# EasyEDA Pro project CameraTarget-0.9.eprj, board PCB1
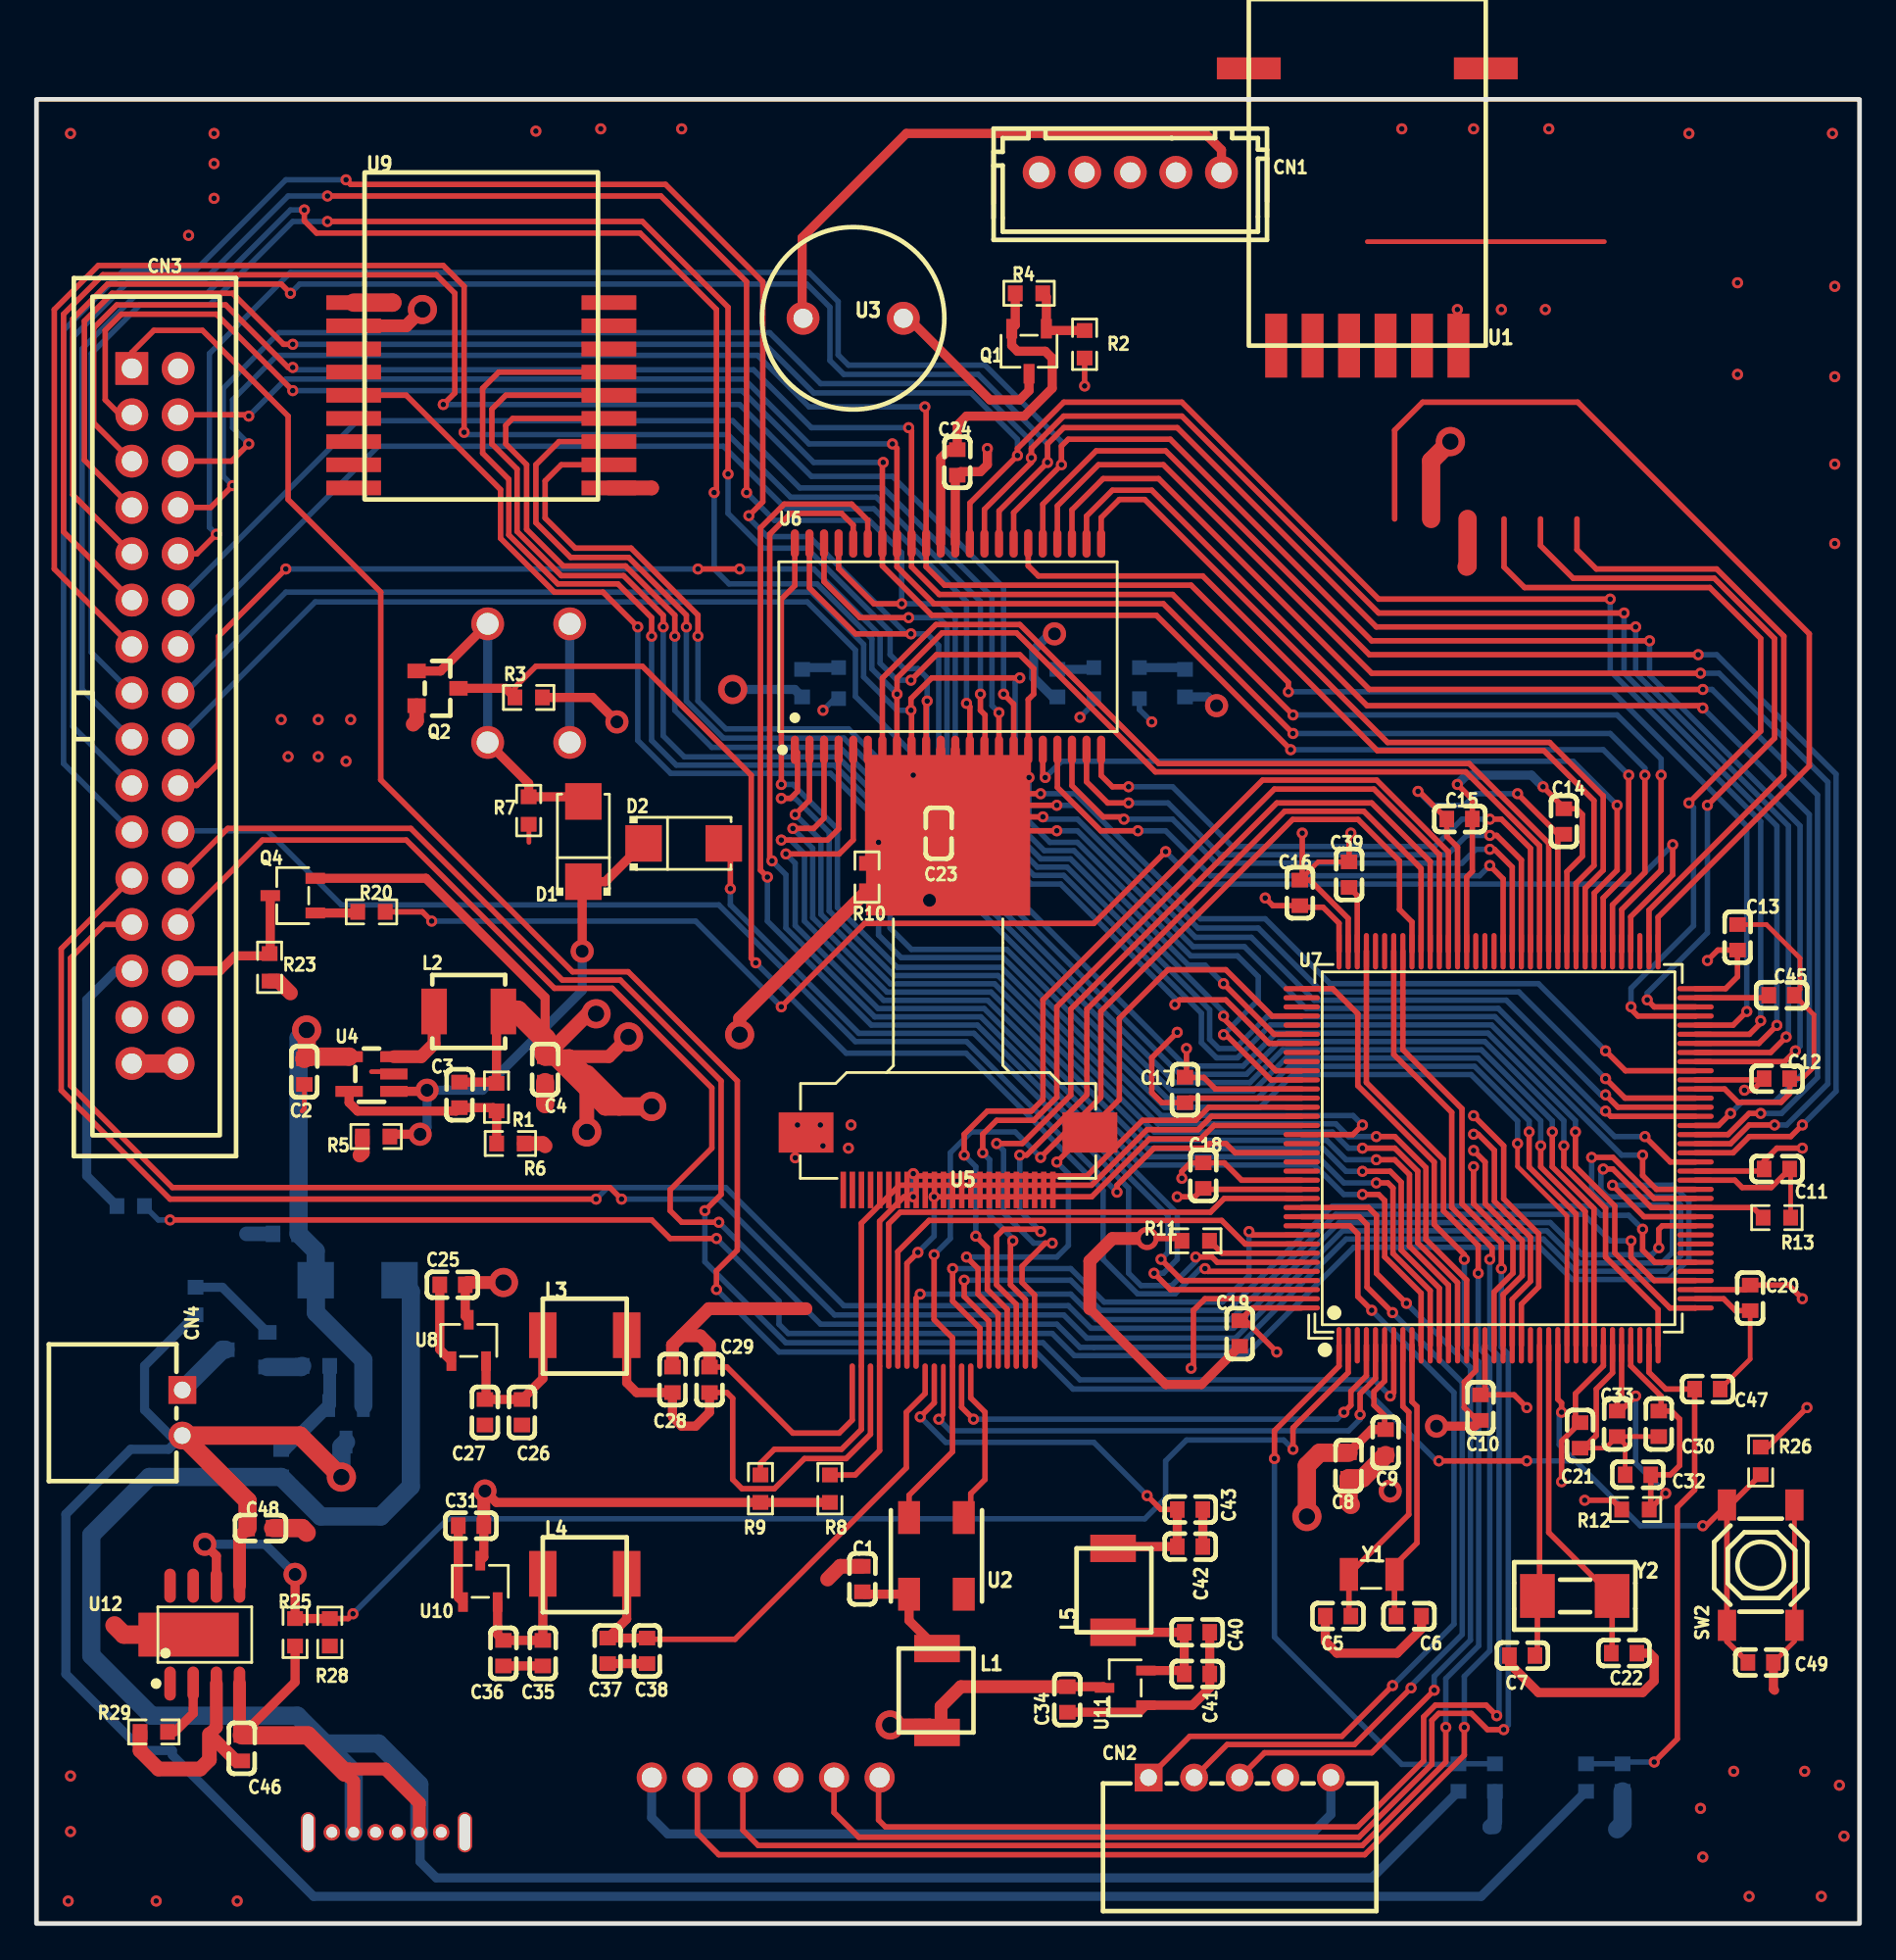
[diagram p1: board, top side]
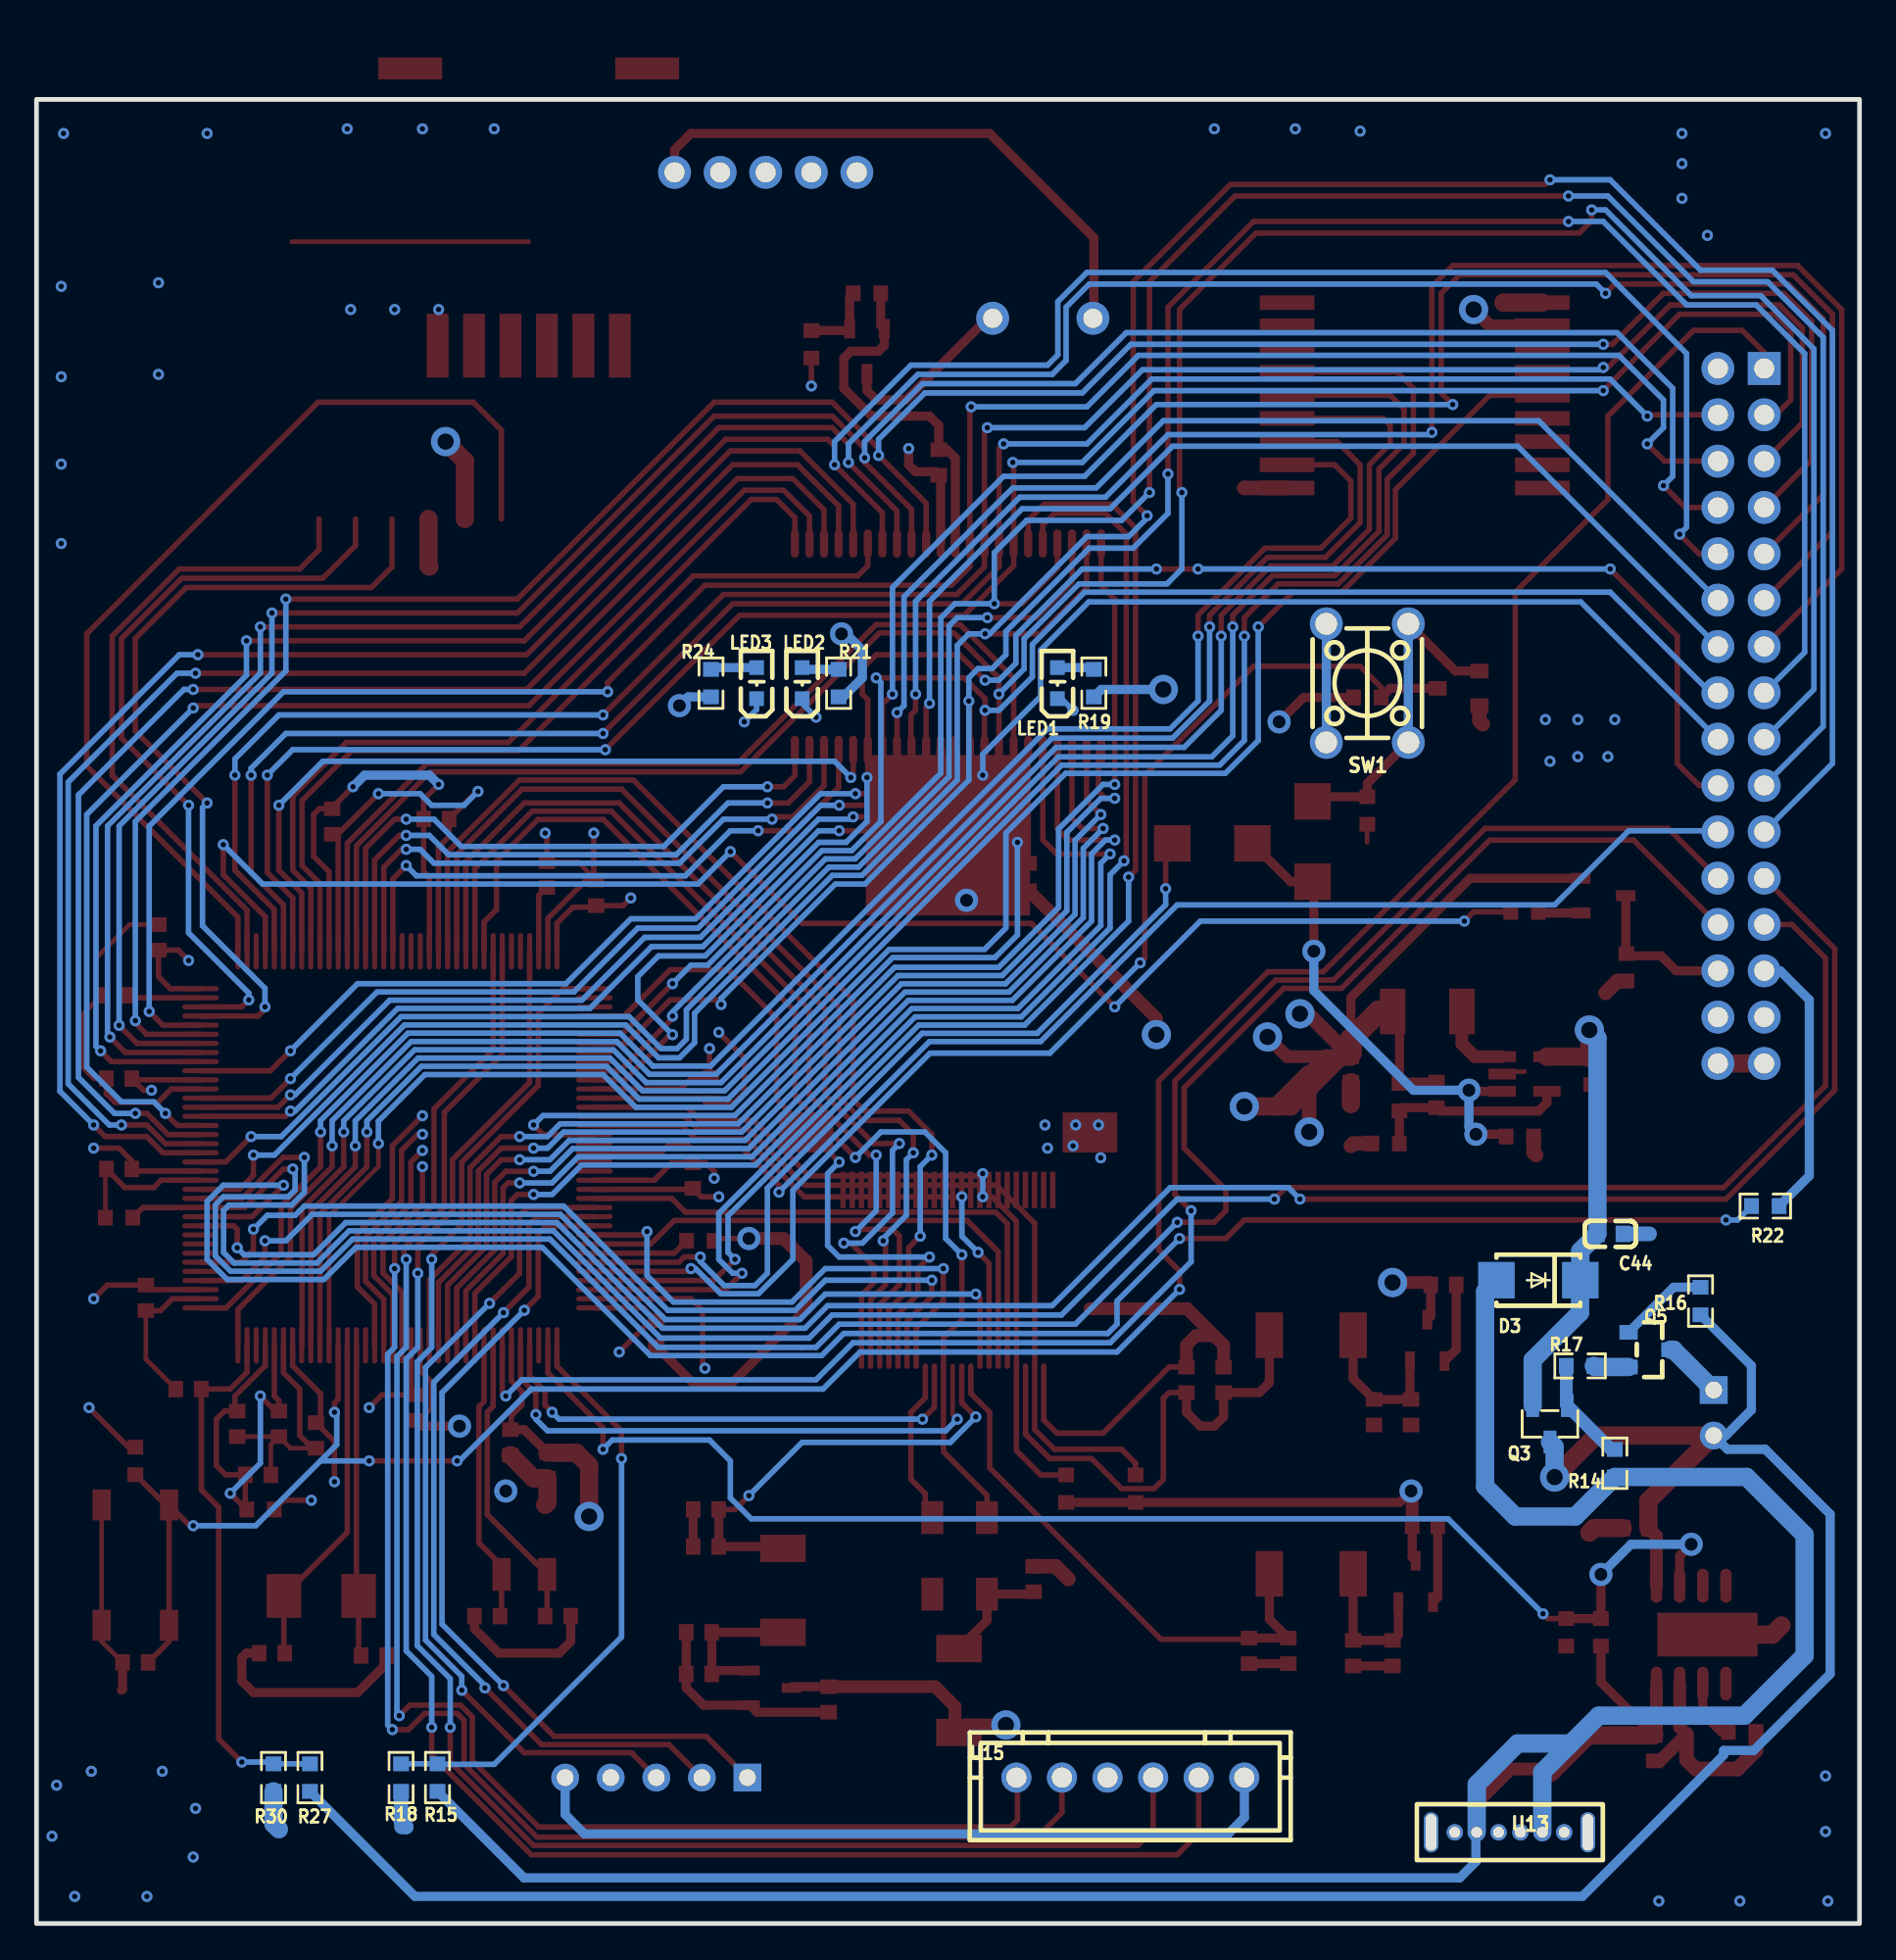
[diagram p2: board, bottom side, seen from below]

Outline 100 x 100 mm; copper layers: Top Layer, CPU1, CPU2, Bottom Layer. Coordinates in mm from the lower left corner of the outline.
Outline path: rectangle 0,100 100,0
Stack: Top Layer 0.035mm / Dielectric1 0.48mm PP er 4.5 / CPU1 0.035mm / Dielectric2 0.48mm FR4 er 4.5 / CPU2 0.035mm / Dielectric3 0.48mm PP er 4.5 / Bottom Layer 0.035mm

## Design rules (mm)
spacing safeClearance (default): track to track 0.152, other pairs 0.152 to 0.3
track width trackWidth (default): min 0.127, default 0.254, max 2.54
differential pair differentialPair (default): width min 0.127, default 0.254, max 2.54; gap min 0.152, default 0.152
via viaSize (default): diameter min 0.5, default 0.61, max 10; hole min 0.3, default 0.305, max 6

## Placement (name value [footprint] x y rotation side)
C1  0.1uF  [C0603]  45.3 18.88 270 top
C2  10uF  [C0603]  14.69 46.7 90 top
C3  22pF  [C0603]  23.2 45.43 270 top
C4  10uF  [C0603]  27.9 46.83 90 top
C5  15pF  [C0603]  71.4 16.85 0 top
C6  15pF  [C0603]  75.27 16.85 180 top
C7  22pF  [C0603]  81.5 14.69 180 top
C8  10uF  [C0603]  71.97 25.11 90 top
C9  0.1uF  [C0603]  74 26.38 90 top
C10  0.1uF  [C0603]  79.21 28.28 90 top
C11  0.1uF  [C0603]  95.47 41.36 180 top
C12  0.1uF  [C0603]  95.47 46.32 180 top
C13  0.1uF  [C0603]  93.31 54.06 270 top
C14  0.1uF  [C0603]  83.78 60.41 270 top
C15  0.1uF  [C0603]  78.06 60.55 180 top
C16  0.1uF  [C0603]  69.3 56.5 270 top
C17  0.1uF  [C0603]  63 45.7 270 top
C18  0.1uF  [C0603]  64 41 270 top
C19  0.1uF  [C0603]  66 32.35 90 top
C20  0.1uF  [C0603]  94 34.3 90 top
C21  0.1uF  [C0603]  84.67 26.76 90 top
C22  22pF  [C0603]  87.08 14.82 0 top
C23  0.1uF  [C0603]  49.49 59.78 90 top
C24  0.1uF  [C0603]  50.51 80.1 270 top
C25  1uF  [C0603]  22.82 35.01 0 top
C26  0.1uF  [C0603]  26.63 28.03 90 top
C27  10uF  [C0603]  24.6 28.03 90 top
C28  10uF  [C0603]  34.89 29.81 270 top
C29  0.1uF  [C0603]  36.92 29.81 270 top
C30  0.1uF  [C0603]  88.99 27.39 90 top
C31  1uF  [C0603]  23.84 21.81 0 top
C32  10uF  [C0603]  87.85 24.6 0 top
C33  2.2uF  [C0603]  86.7 27.39 90 top
C34  1uF  [C0603]  56.55 12.28 90 top
C35  0.1uF  [C0603]  27.78 14.82 90 top
C36  10uF  [C0603]  25.62 14.82 90 top
C37  10uF  [C0603]  31.33 14.95 90 top
C38  0.1uF  [C0603]  33.49 14.95 90 top
C39  2.2uF  [C0603]  72 57.5 270 top
C40  0.1uF  [C0603]  63.66 15.97 180 top
C41  10uF  [C0603]  63.66 13.68 180 top
C42  10uF  [C0603]  63.28 20.67 180 top
C43  0.1uF  [C0603]  63.28 22.7 180 top
C44  4.7uF  [C0603]  13.68 37.81 0 bottom
C45  2.2uF  [C0603]  95.72 50.89 180 top
C46  1uF  [C0603]  11.27 9.61 90 top
C47  0.1uF  [C0603]  91.66 29.3 180 top
C48  4.7uF  [C0603]  12.28 21.68 180 top
C49  0.1uF  [C0603]  94.58 14.31 180 top
CN1  灯板连接口  [CONN-TH_5P-P2.50_HX25003-5A]  60 96 0 top
CN2  HDGC2501WR-5P  [CONN-TH_5P-P2.50_HDGC2501WR-5P]  66 8 0 top
CN3  BH-00169  [IDC-TH_BH-00169]  6.5 66.2 270 top
CN4  HDGC2501WR-2P  [CONN-TH_2P-P2.50_HDGC2501WR-2P]  8 28 270 top
D1  SS14A  [SMA_L4.3-W2.6-LS5.2-RD]  30 59.31 90 top
D2  SS14A  [SMA_L4.3-W2.6-LS5.2-RD]  35.5 59.22 0 top
D3  -  [DO-214AC_L4.3-W2.7-LS5.3-RD]  17.61 35.27 0 bottom
L1  -  [0420]  51.4 15.07 270 top
L2  2.2uH  [IND-SMD_L4.0-W4.0_0.47UH04209.5A]  23.71 50 0 top
L3  -  [0420]  27.78 34.25 0 top
L4  -  [0420]  27.78 21.17 0 top
L5  -  [0420]  57.05 15.97 90 top
LED1  RED  [LED0603-R-RD_RED]  44 68 90 bottom
LED2  NCD0603R3  [LED0603-R-RD_RED]  58 68 90 bottom
LED3  NCD0603R3  [LED0603-R-RD_RED]  60.5 68 90 bottom
Q1  S8050  [SOT-23-3_L2.9-W1.6-P1.90-LS2.8-BR]  54.44 86.19 90 top
Q2  AO3400  [SOT-23_L2.9-W1.3-P1.90-LS2.4-BR]  22 67.72 180 top
Q3  -  [SOT-23-3_L2.9-W1.3-P1.90-LS2.4-BR]  16.98 27.39 90 bottom
Q4  SS8550  [SOT-23-3_L2.9-W1.6-P1.90-LS2.8-BR]  14.06 56.35 0 top
Q5  AO3400  [SOT-23_L2.9-W1.3-P1.90-LS2.4-BR]  11.52 31.46 0 bottom
R1  453kΩ  [R0603]  25.23 45.3 90 top
R2  1kΩ  [R0603]  57.49 86.58 270 top
R3  100kΩ  [R0603]  27 67.22 0 top
R4  10kΩ  [R0603]  54.44 89.37 180 top
R5  100kΩ  [R0603]  18.63 43.14 0 top
R6  100kΩ  [R0603]  26 42.76 180 top
R7  10kΩ  [R0603]  27 61.02 270 top
R8  4.7kΩ  [R0603]  43.52 23.84 270 top
R9  4.7kΩ  [R0603]  39.71 23.84 270 top
R10  10kΩ  [R0603]  45.56 57.37 270 top
R11  10kΩ  [R0603]  63.59 37.43 0 top
R12  10Ω  [R0603]  87.71 22.69 180 top
R13  10kΩ  [R0603]  95.47 38.7 0 top
R14  1kΩ  [R0603]  13.42 25.24 270 bottom
R15  20kΩ  [R0603]  78 8 270 bottom
R16  10kΩ  [R0603]  8.72 34.12 270 bottom
R17  10kΩ  [R0603]  15.33 30.57 0 bottom
R18  30kΩ  [R0603]  80 8 90 bottom
R19  1kΩ  [R0603]  42 68 270 bottom
R20  10kΩ  [R0603]  18.38 55.46 180 top
R21  1kΩ  [R0603]  56 68 270 bottom
R22  10kΩ  [R0603]  5.17 39.33 0 bottom
R23  10kΩ  [R0603]  12.79 52.42 270 top
R24  1kΩ  [R0603]  63 68 270 bottom
R25  20kΩ  [R0603]  14.19 15.96 270 top
R26  10kΩ  [R0603]  94.58 25.36 270 top
R27  300kΩ  [R0603]  85 8 270 bottom
R28  30kΩ  [R0603]  16.09 15.96 90 top
R29  3kΩ  [R0603]  6.44 10.5 0 top
R30  100kΩ  [R0603]  87 8 90 bottom
SW1  -  [按钮开关]  27 68 270 bottom
SW2  1TS001G-2700-1500-CT  [SW-SMD_4P-L5.1-W5.1-P3.70-LS6.5-TL-2]  94.58 19.65 90 top
U1  -  [GC2400-TC010R]  73 96 0 top
U2  -  [5032-4P]  49.37 20.16 90 top
U3  -  [0905蜂鸣器]  44.8 88 0 top
U4  -  [PW2051]  18.38 46.57 0 top
U5  -  [OV2640]  50 50 0 top
U6  IS62WV51216BLL-55TLI  [TSOP-44_L18.4-W10.2-P0.80-LS11.8-BL]  50 70 0 top
U7  STM32F407ZGT6  [LQFP-144_L20.0-W20.0-P0.50-LS22.0-BL]  80.2 42.5 0 top
U8  -  [SOT-23-3_L2.9-W1.6-P1.90-LS2.9-BL]  23.71 31.97 0 top
U9  -  [XY-MBA32A]  18 96 0 top
U10  -  [SOT-23-3_L2.9-W1.6-P1.90-LS2.9-BL]  24.35 18.76 0 top
U11  -  [SOT-23-3_L2.9-W1.6-P1.90-LS2.9-BL]  59.72 12.92 90 top
U12  -  [PW4056]  9.23 15.84 0 top
U13  -  [typec]  19.2 5 180 bottom
U15  HDGC2501WV-6P  [CONN-TH_XH2.54-6P]  40 8 180 bottom
Y1  -  [3215]  73.24 19.14 180 top
Y2  -  [5032]  84.34 17.96 180 top

## Footprints (pads in the part's own frame, mm; a bottom-side part is the same pattern mirrored in y, then rotated)
0420
  rect 1.5x2.5 smd: 1(0,-2) 2(4.6,-2)
0905蜂鸣器
  round 1.8 hole 1.05: 1(-2.75,0) 2(2.75,0)
3215
  rect 1x1.8 smd: 1(-1.25,0) 2(1.25,0)
5032
  rect 1.9x2.401 smd: 1(-2.093,0) 2(2.007,0)
5032-4P
  rect 1.8x1.2 smd: 1(-2.1,-1.5) 2(2.1,-1.5) 3(2.1,1.5) 4(-2.1,1.5)
C0603
  rect 0.8x0.9 smd: 1(-0.7,0) 2(0.7,0)
CONN-TH_2P-P2.50_HDGC2501WR-2P
  rect 1.524x1.524 hole 0.914: 1(-1.25,0)
  round 1.524 hole 0.914: 2(1.25,0)
CONN-TH_5P-P2.50_HDGC2501WR-5P
  rect 1.524x1.524 hole 0.914: 1(-5,0)
  round 1.524 hole 0.914: 2(-2.5,0) 3(0,0) 4(2.5,0) 5(5,0)
CONN-TH_5P-P2.50_HX25003-5A
  round 1.8 hole 1.1: 1(-5,0) 2(-2.5,0) 3(0,0) 4(2.5,0) 5(5,0)
CONN-TH_XH2.54-6P
  round 1.65 hole 1.1: 1(-6.25,0) 2(-3.75,0) 3(-1.25,0) 4(1.25,0) 5(3.75,0) 6(6.25,0)
DO-214AC_L4.3-W2.7-LS5.3-RD
  rect 1.999x1.999 smd: 1(-2.299,0) 2(2.301,0)
GC2400-TC010R
  rect 1.2x3.5 smd: 1(-5,-9.5) 2(-3,-9.5) 3(-1,-9.5) 4(1,-9.5) 5(3,-9.5) 6(5,-9.5)
  rect 3.5x1.2 smd: 7(6.5,5.7) 8(-6.5,5.7)
IDC-TH_BH-00169
  rect 1.8x1.8 hole 1.1: 1(-19.05,-1.27)
  round 1.8 hole 1.1: 2(-19.05,1.27) 3(-16.51,-1.27) 4(-16.51,1.27) 5(-13.97,-1.27) 6(-13.97,1.27) 7(-11.43,-1.27) 8(-11.43,1.27) 9(-8.89,-1.27) 10(-8.89,1.27) 11(-6.35,-1.27) 12(-6.35,1.27) 13(-3.81,-1.27) 14(-3.81,1.27) 15(-1.27,-1.27) 16(-1.27,1.27) 17(1.27,-1.27) 18(1.27,1.27) 19(3.81,-1.27) 20(3.81,1.27) 21(6.35,-1.27) 22(6.35,1.27) 23(8.89,-1.27) 24(8.89,1.27) 25(11.43,-1.27) 26(11.43,1.27) 27(13.97,-1.27) 28(13.97,1.27) 29(16.51,-1.27) 30(16.51,1.27) 31(19.05,-1.27) 32(19.05,1.27)
IND-SMD_L4.0-W4.0_0.47UH04209.5A
  rect 1.399x2.499 smd: 1(-1.9,0) 2(1.9,0)
LED0603-R-RD_RED
  rect 0.8x0.8 smd: 1(0.851,0) 2(-0.851,0)
LQFP-144_L20.0-W20.0-P0.50-LS22.0-BL
  oval 0.28x2 smd: 1(-8.75,-10.8) 2(-8.25,-10.8) 3(-7.75,-10.8) 4(-7.25,-10.8) 5(-6.75,-10.8) 6(-6.25,-10.8) 7(-5.75,-10.8) 8(-5.25,-10.8) 9(-4.75,-10.8) 10(-4.25,-10.8) 11(-3.75,-10.8) 12(-3.25,-10.8) 13(-2.75,-10.8) 14(-2.25,-10.8) 15(-1.75,-10.8) 16(-1.25,-10.8) 17(-0.75,-10.8) 18(-0.25,-10.8) 19(0.25,-10.8) 20(0.75,-10.8) 21(1.25,-10.8) 22(1.75,-10.8) 23(2.25,-10.8) 24(2.75,-10.8) 25(3.25,-10.8) 26(3.75,-10.8) 27(4.25,-10.8) 28(4.75,-10.8) 29(5.25,-10.8) 30(5.75,-10.8) 31(6.25,-10.8) 32(6.75,-10.8) 33(7.25,-10.8) 34(7.75,-10.8) 35(8.25,-10.8) 36(8.75,-10.8) 73(8.75,10.8) 74(8.25,10.8) 75(7.75,10.8) 76(7.25,10.8) 77(6.75,10.8) 78(6.25,10.8) 79(5.75,10.8) 80(5.25,10.8) 81(4.75,10.8) 82(4.25,10.8) 83(3.75,10.8) 84(3.25,10.8) 85(2.75,10.8) 86(2.25,10.8) 87(1.75,10.8) 88(1.25,10.8) 89(0.75,10.8) 90(0.25,10.8) 91(-0.25,10.8) 92(-0.75,10.8) 93(-1.25,10.8) 94(-1.75,10.8) 95(-2.25,10.8) 96(-2.75,10.8) 97(-3.25,10.8) 98(-3.75,10.8) 99(-4.25,10.8) 100(-4.75,10.8) 101(-5.25,10.8) 102(-5.75,10.8) 103(-6.25,10.8) 104(-6.75,10.8) 105(-7.25,10.8) 106(-7.75,10.8) 107(-8.25,10.8) 108(-8.75,10.8)
  oval 2x0.28 smd: 37(10.8,-8.75) 38(10.8,-8.25) 39(10.8,-7.75) 40(10.8,-7.25) 41(10.8,-6.75) 42(10.8,-6.25) 43(10.8,-5.75) 44(10.8,-5.25) 45(10.8,-4.75) 46(10.8,-4.25) 47(10.8,-3.75) 48(10.8,-3.25) 49(10.8,-2.75) 50(10.8,-2.25) 51(10.8,-1.75) 52(10.8,-1.25) 53(10.8,-0.75) 54(10.8,-0.25) 55(10.8,0.25) 56(10.8,0.75) 57(10.8,1.25) 58(10.8,1.75) 59(10.8,2.25) 60(10.8,2.75) 61(10.8,3.25) 62(10.8,3.75) 63(10.8,4.25) 64(10.8,4.75) 65(10.8,5.25) 66(10.8,5.75) 67(10.8,6.25) 68(10.8,6.75) 69(10.8,7.25) 70(10.8,7.75) 71(10.8,8.25) 72(10.8,8.75) 109(-10.8,8.75) 110(-10.8,8.25) 111(-10.8,7.75) 112(-10.8,7.25) 113(-10.8,6.75) 114(-10.8,6.25) 115(-10.8,5.75) 116(-10.8,5.25) 117(-10.8,4.75) 118(-10.8,4.25) 119(-10.8,3.75) 120(-10.8,3.25) 121(-10.8,2.75) 122(-10.8,2.25) 123(-10.8,1.75) 124(-10.8,1.25) 125(-10.8,0.75) 126(-10.8,0.25) 127(-10.8,-0.25) 128(-10.8,-0.75) 129(-10.8,-1.25) 130(-10.8,-1.75) 131(-10.8,-2.25) 132(-10.8,-2.75) 133(-10.8,-3.25) 134(-10.8,-3.75) 135(-10.8,-4.25) 136(-10.8,-4.75) 137(-10.8,-5.25) 138(-10.8,-5.75) 139(-10.8,-6.25) 140(-10.8,-6.75) 141(-10.8,-7.25) 142(-10.8,-7.75) 143(-10.8,-8.25) 144(-10.8,-8.75)
OV2640
  rect 0.3x2 smd: 1(-5.747,-9.785) 2(-5.247,-9.785) 3(-4.747,-9.785) 4(-4.247,-9.785) 5(-3.747,-9.785) 6(-3.247,-9.785) 7(-2.747,-9.785) 8(-2.247,-9.785) 9(-1.747,-9.785) 10(-1.247,-9.785) 11(-0.747,-9.785) 12(-0.247,-9.785) 13(0.253,-9.785) 14(0.753,-9.785) 15(1.253,-9.785) 16(1.753,-9.785) 17(2.253,-9.785) 18(2.753,-9.785) 19(3.253,-9.785) 20(3.753,-9.785) 21(4.253,-9.785) 22(4.753,-9.785) 23(5.253,-9.785) 24(5.753,-9.785)
  rect 3x2.2 smd: 25(7.785,-6.636) 26(-7.785,-6.636)
  rect 9x8.8 smd: 27(0.006,9.658)
PW2051
  rect 1.5x0.6 smd: 1(1.227,-0.95) 2(1.227,0) 3(1.227,0.95) 4(-1.227,0.95) 5(-1.227,-0.95)
PW4056
  oval 0.63x1.865 smd: 1(-1.905,-2.683) 2(-0.635,-2.683) 3(0.635,-2.683) 4(1.905,-2.683) 5(1.905,2.683) 6(0.635,2.683) 7(-0.635,2.683) 8(-1.905,2.683)
  rect 5.5x2.4 smd: 9(-0.889,0)
R0603
  rect 0.807x0.864 smd: 1(-0.754,0) 2(0.754,0)
SMA_L4.3-W2.6-LS5.2-RD
  rect 2x2 smd: 1(-2.2,0) 2(2.2,0)
SOT-23-3_L2.9-W1.3-P1.90-LS2.4-BR
  rect 1.25x0.701 smd: 1(1.001,-0.95) 2(1.001,0.95) 3(-1.001,0)
SOT-23-3_L2.9-W1.6-P1.90-LS2.8-BR
  rect 1.07x0.6 smd: 1(1.235,-0.95) 2(1.235,0.95) 3(-1.235,0)
SOT-23-3_L2.9-W1.6-P1.90-LS2.9-BL
  rect 0.532x1.07 smd: 1(-0.95,-1.135) 2(0.95,-1.135) 3(0,1.135)
SOT-23_L2.9-W1.3-P1.90-LS2.4-BR
  rect 1x0.8 smd: 1(1.15,-0.95) 2(1.15,0.95) 3(-1.15,0)
SW-SMD_4P-L5.1-W5.1-P3.70-LS6.5-TL-2
  rect 1.7x1 smd: 1(-3.3,1.849) 2(3.3,1.851) 3(-3.3,-1.851) 4(3.3,-1.851)
TSOP-44_L18.4-W10.2-P0.80-LS11.8-BL
  oval 0.448x1.551 smd: 1(-8.4,-5.655) 2(-7.6,-5.655) 3(-6.8,-5.655) 4(-6,-5.655) 5(-5.2,-5.655) 6(-4.4,-5.655) 7(-3.6,-5.655) 8(-2.8,-5.655) 9(-2,-5.655) 10(-1.2,-5.655) 11(-0.4,-5.655) 12(0.4,-5.655) 13(1.2,-5.655) 14(2,-5.655) 15(2.8,-5.655) 16(3.6,-5.655) 17(4.4,-5.655) 18(5.2,-5.655) 19(6,-5.655) 20(6.8,-5.655) 21(7.6,-5.655) 22(8.4,-5.655) 23(8.4,5.655) 24(7.6,5.655) 25(6.8,5.655) 26(6,5.655) 27(5.2,5.655) 28(4.4,5.655) 29(3.6,5.655) 30(2.8,5.655) 31(2,5.655) 32(1.2,5.655) 33(0.4,5.655) 34(-0.4,5.655) 35(-1.2,5.655) 36(-2,5.655) 37(-2.8,5.655) 38(-3.6,5.655) 39(-4.4,5.655) 40(-5.2,5.655) 41(-6,5.655) 42(-6.8,5.655) 43(-7.6,5.655) 44(-8.4,5.655)
typec
  round 0.9 hole 0.6: 1(-3,0) 2(-1.8,0) 3(-0.6,0) 4(0.6,0) 5(1.8,0) 6(3,0)
  oval 0.8x2.2 hole 0.6x2: 7(-4.3,0) 8(4.3,0)
XY-MBA32A
  rect 3x0.8 smd: 1(-0.6,-7.14) 2(-0.6,-8.41) 3(-0.6,-9.68) 4(-0.6,-10.95) 5(-0.6,-12.22) 6(-0.6,-13.49) 7(-0.6,-14.76) 8(-0.6,-16.03) 9(-0.6,-17.3) 10(13.4,-17.3) 11(13.4,-16.03) 12(13.4,-14.76) 13(13.4,-13.49) 14(13.4,-12.22) 15(13.4,-10.95) 16(13.4,-9.68) 17(13.4,-8.41) 18(13.4,-7.14)
按钮开关
  round 1.8 hole 1.2: 1(-3.25,2.25) 2(3.25,2.25) 3(-3.25,-2.25) 4(3.25,-2.25)

## Nets
As in the schematic.

Pads without a net: U2 1; U5 1 23 24 27; U7 3 22 34 41 43 44 45 75 91 92 93 103 104 110 111 113 116 117 126 128 129; U9 3 4 6 7 8 9 16 17 18; U12 1 7 8; U13 3 4 7 8

## Via types
v1: diameter 0.61, hole 0.305, Top Layer to Bottom Layer, 275 vias
v2: diameter 1.27, hole 0.711, Top Layer to Bottom Layer, 13 vias
v3: diameter 1.6, hole 0.9, Top Layer to Bottom Layer, 13 vias

## Routing (per net, layer and track width the routed paths; a pad name or vN(x,y) marks a point on that pad's centre or on a via; arc(x,y) is an arc through that point)
+3.3V: length 834.5
  Top Layer w0.3: R26.1 94.95,26.12 v1(97.12,28.28) ; C17.2 61.73,45 61.18,45.56 61.18,47.46 v1(62.57,48.86) ; U7.143 64.09,34.25 63.46,33.62 63.46,30.57 v1(63.34,30.44) ; 63,44.98 63.27,45.25 U7.121 ; v1(84.93,23.2) 86.45,23.2 R12.2 ; v1(81.24,61.94) 83.47,59.71 83.5,59.71 ; U7.6 73.95,29.75 73.37,29.17 73.37,28.42 73.95,27.83 73.95,27.13 C9.2 ; U7.144 66.7,33.75 C19.2 66.32,33.05 v1(68.03,31.33) ; v1(93.69,45.68) 94.13,45.68 94.7,46.25 ; v1(67.4,56.22) 67.82,55.8 C16.2 69.38,55.72 70.57,55.72 71.45,54.84 U7.108 ; v1(83.66,24.22) 83.66,26.44 84.67,27.46 84.42,27.71 84.42,29.04 85.95,30.58 U7.30 ; U7.52 94.65,41.25 C11.2 94.77,41.81 95.47,42.51 v1(96.86,42.51) ; U7.95 77.95,59.01 77.36,59.59 C15.2 75.85,62.06 v1(75.78,62.06) ; v1(62.57,39.84) 63.54,39.84 C18.2 64.05,40.25 U7.131 ; v1(91.66,52.79) 92.23,53.36 C13.2 93.31,51.91 92.65,51.25 U7.72 ; U7.17 79.45,29.22 79.21,28.98 81.05,28.98 v1(81.75,28.28) ; U7.39 93.75,34.75 C20.2 96.12,35 v1(96.86,34.25) ; C12.2 94.7,46.25 ; 94.7,46.25 U7.62 ; 83.5,59.71 83.45,59.67 U7.84 ; 83.5,59.71 C14.2
  Top Layer w0.5: C25.2 23.52,33.29 23.71,33.1 ; C24.2 50.7,79.59 51.78,79.59 52.16,79.97 v1(52.16,80.86) ; R8.2 R9.2 25.23,23.08 v2(24.6,23.71) ; Q4.2 21.36,57.3 27.9,50.76 27.9,48.48 ; v2(31.84,65.88) 30.5,67.22 R3.2 ; 50.38,79.4 50.4,79.38 U6.33 ; C3.1 25.16,46.13 R1.2 25.23,49.62 L2.2 ; 49.62,60.48 49.6,60.5 U6.11 ; U11.3 58.52,12.98 C34.2 ; U3.1 42,88.05 42,92.42 47.71,98.13 64.1,98.13 65,97.23 CN1.5 ; U10.3 24.54,20.09 C31.2 ; C9.2 73.24,27.08 C8.2
  Top Layer w0.7: 29.23,47.53 31.4,47.53 v3(32.47,48.6) ; C25.2 23.65,35.14 v3(25.62,35.14) ; C23.2 48.03,60.48 47.33,59.78 47.33,57.49 46.45,56.61 R10.2 38.57,49.63 v3(38.57,48.73) ; C34.2 50.7,12.98 49.62,11.9 49.62,10.7 L1.2 48.99,10.88 v3(46.82,10.88) ; v3(21.17,88.48) 20.28,87.59 U9.2 ; v2(24.6,23.71) 24.54,23.65 C31.2
  Top Layer w0.8: C4.2 30.25,49.87 v3(30.7,49.87) ; 28.47,47.53 29.23,47.53 30.19,46.57 v3(30.19,43.4)
  Top Layer w1: 31.97,44.79 31.2,44.79 28.47,47.53 C4.2 27.9,47.71 ; 31.97,44.79 v3(33.74,44.79) ; 31.97,44.79 30.19,46.57 ; 76.5,77 76.5,80.18 v3(77.56,81.24) ; v3(69.69,22.31) 69.69,25.11 70.38,25.81 C8.2 ; CN3.31 CN3.32
  Top Layer w1.2: L2.2 26.38,50 27.9,48.48 27.9,47.71
  CPU1 w0.3: v1(96.86,42.51) 98.64,42.51 ; 84.12,22.31 84.12,22.4 v1(84.93,23.2) ; 95.59,32.42 96.86,33.69 v1(96.86,34.25) ; 82.33,22.31 83.66,23.64 v1(83.66,24.22) ; 66.38,58.3 67.4,57.28 v1(67.4,56.22) ; 95.59,29.59 95.81,29.59 v1(97.12,28.28) ; 98.64,55.81 95.62,52.79 v1(91.66,52.79) ; v1(93.69,45.68) 97.37,45.68 98.64,46.95 ; v1(68.03,31.33) 65.24,28.54 63.34,28.54 62.19,29.68 ; v1(62.57,48.86) 62.02,48.86 61.18,49.7 ; 77.08,22.31 81.75,26.98 v1(81.75,28.28) ; 66.38,63.96 68.28,62.06 v1(75.78,62.06) ; v1(62.57,39.84) 61.18,41.24 ; v1(63.34,30.44) 62.19,31.59
  CPU1 w0.5: v2(55.84,70.7) 60.79,70.7 v2(64.73,66.76) 66.38,68.42 ; 66.38,85.31 64.35,83.27 54.57,83.27 v1(52.16,80.86) ; v3(38.19,67.65) 33.87,63.33 33.87,49.87 32.6,48.6 v3(32.47,48.6)
  CPU1 w0.7: v3(21.17,88.48) 21.17,77.81 25.11,73.88 29.3,73.88 31.84,71.34 v2(31.84,65.88) ; v3(33.74,44.79) 37.68,48.73 v3(38.57,48.73) ; v3(32.47,48.6) 25.62,41.75 v3(25.62,35.14) 25.62,24.73 v2(24.6,23.71)
  CPU1 w0.8: CN3.32 9.62,45.3 15.2,45.3 19.77,49.87 v3(30.7,49.87) 31.84,51.02 v2(31.84,65.88) ; v3(46.82,10.88) 36.79,10.88 33.8,13.87 ; 33.8,13.87 27.78,19.9 27.78,40.98 v3(30.19,43.4) ; 33.8,13.87 33.75,13.82 U15.6
  CPU1 w1: 60.16,24.98 62.19,27.01 62.19,31.74 59.27,34.67 59.27,38.19 61.18,40.09 61.18,52.03 66.38,57.24 66.38,94.62 CN1.5 ; 60.16,24.98 67.02,24.98 v3(69.69,22.31) 89.75,22.31 95.59,28.16 95.59,39.46 98.64,42.51 98.64,67.91 85.31,81.24 v3(77.56,81.24) 77.56,81.37 ; 60.16,24.98 42.25,24.98 35.52,31.71 35.52,43.02 v3(33.74,44.79)
  Bottom Layer w0.3: v1(75.78,62.06) 76.54,61.3 78.32,61.3 78.96,61.94 v1(81.24,61.94)
  Bottom Layer w0.5: U15.6 33.74,7.99 33.74,5.8 34.63,4.91 69.94,4.91 71,5.98 CN2.5 ; v2(55.84,70.7) 55.59,70.7 54.7,69.81 54.7,68.29 55.74,67.25 R21.2 ; R19.2 41.59,67.65 v3(38.19,67.65) ; R24.2 64.25,67.25 v2(64.73,66.76)
+3.7V: length 193.4
  Top Layer w0.7: U12.5 11.14,21.24 C48.2
  Top Layer w1: v3(16.73,24.47) 14.45,26.75 CN4.2 11.58,23.17 C48.2
  CPU2 w0.5: CN4.2 8.12,26.63 10.38,26.63 16.85,33.11 16.85,52.35 SW1.4
  Bottom Layer w0.5: SW1.3 SW1.4 ; R27.2 79.24,1.49 15.2,1.49 7.45,9.23 7.45,9.49 5.8,9.49 1.61,13.68 1.61,22.44 5.17,26 7.25,26 CN4.2 7.34,26.75 5.93,28.16 5.93,30.58 R16.2
  Bottom Layer w1: Q3.3 16.73,26.14 v3(16.73,24.47)
AVDD: length 28.9
  Top Layer w0.3: C29.2 37.87,29.11 38.19,28.79 38.19,24.35 38.7,23.84 40.47,23.84 42.13,25.49 44.41,25.49 45.75,26.82 45.75,30.56
  Top Layer w0.5: L3.2 32.38,29.65 32.92,29.11 C28.2 34.89,27.78 35.4,27.27 36.16,27.27 36.92,28.03 C29.2
DVDD: length 30.3
  Top Layer w0.3: 48.75,30.56 48.75,29.06 47.71,28.03 47.71,24.98 38.32,15.58 33.56,15.58 C38.2
  Top Layer w0.5: L4.2 32.38,16.69 C37.2 C38.2
GND: length 440
  Top Layer w0.254: C20.1 94,30.94 C47.1 ; R7.2 27.01,60.25 27.01,59.27 ; U4.2 19.48,46.7 18.38,46.7 ; C11.1 96.22,41.31 R13.2 ; SW2.4 96.43,15.46 C49.1 ; C21.1 86.07,26.06 C33.1 ; C39.1 70.3,58.2 C16.1 ; C33.1 87.15,26.25 C32.1 ; C33.1 88.61,26.69 ; 14.57,44.54 14.69,44.67 C2.1 ; 73,92.2 86,92.2 ; C13.1 94.89,54.76 96.74,52.92 96.74,51.2 C45.1 97.5,49.81 97.5,46.95 96.86,46.32 C12.1
  Top Layer w0.3: U7.130 66.11,40.75 65.16,41.7 C18.1 63.29,41.7 62.83,41.24 v1(62.83,40.86) ; C16.1 69.85,57.2 71.95,55.1 U7.107 ; 84.86,26.06 85.56,26.75 85.56,29.3 86.45,30.19 U7.31 ; U7.120 64.66,45.75 64.03,46.38 63,46.38 ; U7.83 83.95,57.66 84.8,58.51 84.8,60.8 84.48,61.11 C14.1 83.78,61.18 v1(82.64,62.32) ; 36.92,30.51 37.87,30.51 41.49,26.89 44.03,26.89 44.75,27.6 44.75,30.56 ; 51.25,30.56 51.25,28.81 52.03,28.03 52.03,24.35 51.25,23.56 51.25,22.64 U2.2 ; U7.38 92.55,34.25 93.2,33.6 C20.1 ; v1(63.08,47.97) 63.08,46.48 C17.1 ; U7.61 92.6,45.75 93.33,45.02 95.69,45.02 96.17,45.49 C12.1 ; v1(72.1,59.78) 72,59.68 C39.1 ; U7.16 78.95,30.31 78.32,29.68 78.32,28.28 79.02,27.58 C10.1 ; U7.51 93.16,40.75 93.56,40.35 95.15,40.35 C11.1 ; v1(77.94,62.45) 78.76,61.62 C15.1 78.76,57.68 78.45,57.37 U7.94 ; v2(60.92,37.55) 62.71,37.55 R11.1 ; v1(69.43,59.78) 69.43,57.33
  Top Layer w0.5: C40.1 C41.1 64.36,12.92 63.4,11.97 U11.1 60.47,11.58 C34.1 ; C49.1 95.28,12.85 95.34,12.79 ; C7.2 80.79,14.25 82.38,12.66 88.1,12.66 88.74,13.3 88.74,14.57 88.48,14.82 C22.2 ; C38.1 C37.1 ; R4.2 53.69,87.63 Q1.2 53.5,86.51 53.81,86.19 55.33,86.19 55.72,85.81 55.72,84.16 54.19,82.64 51.02,82.64 50.51,82.13 C24.1 50.06,80.8 49.6,80.33 U6.34 ; 22.76,30.83 22.12,31.47 C25.1 ; U10.1 23.14,17.88 C31.1 ; 57.78,33.71 61.93,29.55 63.91,29.55 C19.1 ; C10.1 78.89,27.27 v2(76.8,27.27) ; C6.1 75.97,16.16 74.64,14.82 71.34,14.82 70.7,15.46 C5.1 ; 49.62,59.08 50.4,59.86 U6.12 ; v2(48.98,56.1) 49.49,56.6 C23.1 ; 63.98,22.7 63.98,20.67 ; C35.1 C36.1
  Top Layer w0.7: 34.89,30.51 34.89,31.71 35.4,32.22 ; 35.4,32.22 36.41,32.22 36.92,31.71 36.92,30.51 ; 35.4,32.22 36.88,33.71 42.21,33.71 ; U12.3 9.87,10.76 9.49,10.38 10.95,8.91 C46.1 ; v2(60.92,37.55) 59.02,37.55 57.78,36.32 57.78,33.71
  Top Layer w0.8: 33.74,78.7 33.74,78.7 U9.10 ; C1.1 44.1,19.59 43.4,18.88 ; R29.1 5.68,9.48 6.69,8.47 8.98,8.47 9.49,8.98 9.49,10.38 ; R6.1 27.78,42.76 27.9,42.63 ; 17.74,42.13 17.88,42.26 R5.1 ; 13.93,51.02 13.28,51.67 R23.2 ; Q2.2 20.85,65.94 20.66,65.75
  Top Layer w1: 72.1,22.95 71.97,23.08 C8.1 72.73,24.41 C9.1 ; C4.1 27.9,44.92 ; 78.45,74.38 78.5,74.44 78.5,77 ; U9.1 19.52,88.86 19.52,88.86 ; U12.9 4.79,15.84 4.28,16.34 ; 14.82,21.43 14.57,21.68 C48.1
  CPU1 w0.254: 61.05,37.43 v2(60.92,37.55)
  CPU1 w0.3: v1(77.94,62.45) 77.94,61.43 76.29,59.78 v1(72.1,59.78) 72.1,45.94 63.34,37.17 61.3,37.17 61.05,37.43 62.83,37.43 69.43,44.03 v1(69.43,59.78) ; v1(63.08,47.97) 63.08,41.11 v1(62.83,40.86) 63.46,40.22 63.46,39.08 61.94,37.55 v2(60.92,37.55)
  CPU1 w0.5: CN1.4 62.5,93.87 59.53,90.89 53.94,90.89 49.87,86.83 49.87,56.98 v2(48.98,56.1) ; v2(74.26,23.71) 74.26,24.73 v2(76.8,27.27)
  Bottom Layer w0.5: v1(82.64,62.32) 82,62.95 78.45,62.95 v1(77.94,62.45)
  Bottom Layer w0.8: R18.1 80,5.58 79.72,5.3 79.97,5.3 ; C44.1 11.52,37.81
  Bottom Layer w1: 86.7,5.17 87,5.47 R30.1 ; 12.67,30.51 14.51,30.51 R17.1
  vias: v1(1.74,1.23) v1(1.87,98.13) v1(1.87,8.09) v1(1.87,5.04) v1(6.57,1.23) v1(8.34,92.55) v1(9.74,98.13) v1(9.74,96.48) v1(9.74,94.58) v1(11.01,1.23) v1(13.42,66) v1(13.81,63.97) v1(15.46,66) v1(15.46,63.97) v1(16.98,63.72) v1(17.23,66) v1(27.39,98.26) v1(30.95,98.39) v1(35.39,98.39) v1(41.62,41.98) v1(41.75,43.78) v1(43,43.78) v1(43.14,42.63) v1(44.54,42.51) v1(44.68,43.78) v1(74.89,98.39) v1(77.94,88.48) v1(78.83,98.39) v1(80.35,88.48) v1(82.77,88.48) v1(82.96,98.39) v1(90.64,98.13) v1(91.28,6.31) v1(91.4,3.65) v1(93.1,8.34) v1(93.31,89.95) v1(93.31,84.92) v1(93.94,1.49) v1(96.99,8.34) v1(97.9,1.49) v1(98.51,98.13) v1(98.64,89.75) v1(98.64,84.8) v1(98.64,80.01) v1(98.64,75.65) v1(98.9,7.58) v1(99.15,4.79)
VIN: length 26.2
  Top Layer w1: U4.4 17.14,47.53 14.82,47.53 ; 14.82,47.53 14.69,47.4 ; 14.82,47.53 v3(14.82,48.98)
  Bottom Layer w1: Q3.2 17.93,30.89 15.33,33.49 15.33,35.26 D3.1 15.32,36.87 14.38,37.81 14.38,48.54 v3(14.82,48.98)
ADC_BAT: length 29.5
  Top Layer w0.3: v1(88.74,8.85) 90,10.12 90,22.82 90.96,23.77 C47.2 89.37,29.3 88.45,30.22 U7.35
  Bottom Layer w0.3: R27.1 R30.2 87.1,8.85 v1(88.74,8.85)
BAT_CHRG: length 32.5
  Top Layer w0.3: v1(67.91,25.49) 67.91,27.01 71.45,30.56 U7.1
  Bottom Layer w0.3: R18.2 R15.1 77.97,8.72 74.89,8.72 67.91,15.71 v1(67.91,25.49)
BAT_DONE: length 77.7
  Top Layer w0.3: v1(17.36,16.98) 17.1,16.72 R28.2 ; U7.2 71.95,30.2 68.92,27.17 v1(68.92,26)
  Top Layer w0.5: v2(9.23,20.79) 9.87,20.16 U12.6 ; R28.2 R25.1 v2(14.19,19.14)
  Bottom Layer w0.3: v1(17.36,16.98) 22.57,22.19 60.79,22.19 61.94,23.33 61.94,25.36 63.08,26.5 68.41,26.5 v1(68.92,26)
  Bottom Layer w0.5: v2(14.19,19.14) 12.53,20.79 v2(9.23,20.79)
BEEP: length 66.2
  Top Layer w0.3: U7.21 81.45,33.95 82.4,34.9 82.4,37.81 80.48,39.73 80.48,42.63 v1(78.83,44.28) ; v1(57.49,84.29) R2.2
  CPU2 w0.3: v1(78.83,44.28) 76.54,44.28 64.35,56.48 64.35,64.1 62.45,66 62.45,79.34 v1(57.49,84.29)
BLE_BRTS: length 104
  Top Layer w0.3: v1(81.88,43.4) 81.88,41.47 84.45,38.9 U7.27 ; v1(33.74,70.57) 33.74,71.59 31.89,73.44 28.6,73.44 25.91,76.13 25.91,79.17 24.47,80.61 24.47,84.16 25.36,85.05 U9.15
  Bottom Layer w0.3: v1(33.74,70.57) 33.74,64.86 35.1,63.51 43.76,63.51 62.07,45.2 66.93,45.2 68.73,46.99 78.88,46.99 81.88,44 v1(81.88,43.4)
BLE_CDS: length 99.5
  Top Layer w0.3: U9.13 26.12,82.51 25.74,82.13 25.74,81.11 26.89,79.97 26.89,76.43 28.89,74.42 32.31,74.42 35.01,71.72 v1(35.01,70.57) ; v1(83.15,43.4) 83.15,41.48 85.43,39.2 85.43,31.72 U7.29
  Bottom Layer w0.3: v1(35.01,70.57) 35.01,66.51 37.05,64.48 44.07,64.48 62.44,46.1 66.56,46.1 68.35,47.9 79.26,47.9 83.15,44.01 v1(83.15,43.4)
BLE_LINK: length 102.2
  Top Layer w0.3: v1(82.51,42.63) 82.51,41.48 84.95,39.04 U7.28 ; v1(34.38,71.08) 34.38,71.72 32.2,73.89 28.78,73.89 26.36,76.31 26.36,79.73 24.98,81.11 24.98,83.02 25.74,83.78 U9.14
  Bottom Layer w0.3: v1(82.51,42.63) 82.51,44 79.07,47.44 68.54,47.44 66.75,45.65 62.26,45.65 43.95,63.96 35.53,63.96 34.38,65.11 v1(34.38,71.08)
BLE_RST: length 103.5
  Top Layer w0.254: v1(81.24,42.76) 81.24,41.5 83.95,38.79 U7.26
  Top Layer w0.3: v1(32.98,71.08) 31.08,72.99 28.41,72.99 25.46,75.94 25.46,78.61 20.28,83.78 U9.5
  Bottom Layer w0.3: v1(32.98,71.08) 32.98,64.86 34.79,63.05 43.55,63.05 46.82,59.78 46.82,54.57 47.99,53.41 53.22,53.41 61.88,44.75 67.12,44.75 68.92,46.54 78.69,46.54 81.24,43.99 v1(81.24,42.76)
DCMI_D0: length 58.6
  Top Layer w0.3: U7.96 77.45,58.75 73.51,62.68 67.26,62.68 55.21,50.64 55.21,45.17 54.57,44.54 52.16,44.54 50.89,43.27 v1(50.89,42.13) ; 53.25,30.56 53.25,33.67 52.16,34.76 52.16,37.05 v1(51.52,37.68)
  Bottom Layer w0.3: v1(51.52,37.68) 51.52,41.49 v1(50.89,42.13)
DCMI_D1: length 56.4
  Top Layer w0.3: v1(51.91,42.25) 51.91,43.27 52.67,44.03 54.7,44.03 55.97,45.3 55.97,50.25 67.91,62.19 73.36,62.19 76.95,58.61 U7.97 ; 54.25,30.56 54.25,34.2 53.43,35.01 53.43,37.3 v1(53.56,37.43)
  Bottom Layer w0.3: v1(51.91,42.25) 52.29,41.87 52.29,38.82 53.56,37.55 v1(53.56,37.43)
DCMI_D2: length 55.8
  Top Layer w0.3: v1(52.67,42.76) 54.07,42.76 56.73,45.42 56.73,50.13 68.03,61.43 73.24,61.43 76.45,58.22 U7.98 ; v1(55.72,37.3) 55.33,37.3 54.06,36.03 54.06,35.14 54.75,34.46 54.75,30.56
  Bottom Layer w0.3: v1(55.72,37.3) 54.7,37.3 53.05,38.95 53.05,42.38 v1(52.67,42.76)
DCMI_D3: length 53.3
  Top Layer w0.3: v1(55.08,37.94) 54.95,38.06 53.05,38.06 52.67,37.68 52.67,35.01 53.75,33.93 53.75,30.56 ; U7.99 75.95,57.83 72.8,60.98 68.47,60.98 57.62,50.13 57.62,45.43 54.32,42.13 v1(53.94,42.13)
  Bottom Layer w0.3: v1(53.94,42.13) 53.94,39.08 v1(55.08,37.94)
DCMI_D4: length 38.8
  Top Layer w0.3: 52.75,30.56 52.75,33.41 51.65,34.51 51.65,35.9 v1(51.02,36.54) ; v1(55.97,41.75) 59.4,45.17 59.4,49.62 62.06,52.29 65.24,52.29 67.78,49.75 69.4,49.75 U7.112
  Bottom Layer w0.3: v1(55.97,41.75) 56.6,41.11 56.6,37.17 55.97,36.54 v1(51.02,36.54)
DCMI_D5: length 29
  Top Layer w0.3: v1(50.25,35.9) 50.25,34.12 51.75,32.63 51.75,30.56 ; v1(66.51,37.94) 66.69,37.75 U7.136
  Bottom Layer w0.3: v1(66.51,37.94) 66.51,35.52 65.06,34.07 58.56,34.07 56.73,35.9 v1(50.25,35.9)
DCMI_D6: length 27.8
  Top Layer w0.3: v1(51.4,27.65) 50.75,28.3 50.75,30.56 ; v1(71.72,28.03) 72.1,28.41 72.1,29.18 72.95,30.03 U7.4
  Bottom Layer w0.3: v1(71.72,28.03) 71.34,27.65 v1(51.4,27.65)
DCMI_D7: length 31.1
  Top Layer w0.254: 49.75,30.56 49.75,27.9 v1(49.49,27.65)
  Top Layer w0.3: U7.5 73.45,29.89 72.61,29.04 v1(72.61,27.9)
  Bottom Layer w0.3: v1(72.61,27.9) 72.61,27.65 71.97,27.01 50.13,27.01 v1(49.49,27.65)
DCMI_HSYNC: length 51.6
  Top Layer w0.3: v1(48.48,34.51) 48.25,34.28 48.25,30.56 ; v1(87.47,37.43) 87.47,36.52 88.74,35.25 U7.40
  Bottom Layer w0.3: v1(48.48,34.51) 56.73,34.51 58.13,33.11 65.5,33.11 71.27,38.88 84.87,38.88 86.32,37.43 v1(87.47,37.43)
DCMI_PXCLK: length 50.4
  Top Layer w0.3: 52.25,30.56 52.25,33.02 50.89,34.38 v1(50.89,35.27) ; U7.42 88.77,36.25 88.1,36.92 v1(88.1,38.06)
  Bottom Layer w0.3: v1(88.1,38.06) 87.34,38.82 85.81,38.82 85.31,39.33 71.08,39.33 65.37,33.62 58.38,33.62 56.73,35.27 v1(50.89,35.27)
DCMI_VSYNC: length 29.7
  Top Layer w0.3: U7.137 66.31,37.25 65.01,38.54 48.96,38.54 47.25,36.83 47.25,30.56
DOVDD: length 24.9
  Top Layer w0.3: v1(48.48,27.78) 49.25,28.55 49.25,30.56 ; C43.2 61.68,22.7 v1(60.92,23.46)
  Top Layer w0.5: L5.2 59.15,20.67 C42.2 C43.2
  Bottom Layer w0.3: v1(60.92,23.46) 58,26.38 49.87,26.38 v1(48.48,27.78)
FSMC_A0: length 60.4
  Top Layer w0.3: v1(41.11,58.64) 44.03,58.64 44.8,59.41 U6.5 ; v1(72.73,39.97) 73.62,39.97 73.96,39.63 73.96,36.55 75.95,34.55 U7.10
  Bottom Layer w0.3: v1(72.73,39.97) 71.71,39.97 70.1,41.58 60.56,41.58 51.99,50.16 46.17,50.16 41.62,54.71 41.62,58.13 v1(41.11,58.64)
FSMC_A1: length 60.8
  Top Layer w0.3: U6.4 44,60 43.4,59.4 v1(40.86,59.4) ; v1(73.5,40.6) 74.13,40.6 74.41,40.32 74.41,36.73 76.45,34.69 U7.11
  Bottom Layer w0.3: v1(73.5,40.6) 71.72,40.6 70.29,42.03 60.75,42.03 52.17,50.61 46.47,50.61 42.13,54.95 42.13,58.64 41.36,59.4 v1(40.86,59.4)
FSMC_A2: length 59.1
  Top Layer w0.3: U6.3 43.2,60.6 42.63,60.03 v1(41.49,60.03) ; U7.12 76.95,34.83 74.86,36.92 74.86,40.63 74.26,41.24 v1(72.73,41.24)
  Bottom Layer w0.3: v1(72.73,41.24) 71.83,41.24 70.58,42.48 60.94,42.48 52.36,51.06 46.66,51.06 42.58,55.14 42.58,58.95 v1(41.49,60.03)
FSMC_A3: length 58.4
  Top Layer w0.3: v1(73.5,41.87) 74.5,41.87 75.31,41.06 75.31,37.13 77.45,35 U7.13 ; v1(41.62,60.8) 42.4,61.58 U6.2
  Bottom Layer w0.3: v1(41.62,60.8) 43.03,59.38 43.03,55.33 46.84,51.52 52.55,51.52 61.13,42.94 70.77,42.94 71.84,41.87 v1(73.5,41.87)
FSMC_A4: length 59.7
  Top Layer w0.3: v1(72.73,42.51) 74.51,42.51 75.76,41.25 75.76,37.32 77.95,35.14 U7.14 ; v1(40.86,61.68) 41.36,61.68 41.75,62.06 41.75,64.2 U6.1
  Bottom Layer w0.3: v1(40.86,61.68) 41.62,61.68 43.48,59.82 43.48,55.52 47.03,51.97 52.74,51.97 61.32,43.39 71.09,43.39 71.97,42.51 v1(72.73,42.51)
FSMC_A5: length 70.8
  Top Layer w0.3: U7.15 78.45,35.28 76.22,37.51 76.22,41.44 74.51,43.14 v1(73.5,43.14) ; U6.44 41.6,73.35 40.86,72.61 v1(40.86,62.45)
  Bottom Layer w0.3: v1(40.86,62.45) 41.5,62.45 43.94,60.01 43.94,55.7 47.22,52.42 52.93,52.42 61.51,43.84 71.27,43.84 71.97,43.14 v1(73.5,43.14)
FSMC_A6: length 170
  Top Layer w0.3: v1(39.08,77.18) 39.84,77.94 39.84,90 34.51,95.34 17.23,95.34 v1(16.98,95.59) ; U6.43 42.4,73.22 44.92,70.7 v1(47.97,70.7) ; U7.50 88.86,40.25 88.1,41.01 v1(88.1,42.13)
  Bottom Layer w0.3: CN3.21 1.49,63.59 1.49,87.34 4.79,90.64 8.72,90.64 13.68,95.59 v1(16.98,95.59) ; v1(88.1,42.13) 86.95,42.13 79.81,49.26 67.68,49.26 65.88,47.46 64.73,47.46 63.9,48.29 63.9,49.91 56.34,57.46 54.72,57.46 49.49,62.69 49.49,70.07 48.86,70.7 v1(47.97,70.7) 47.71,70.7 42.38,76.03 40.09,76.03 39.08,77.05 v1(39.08,77.18)
FSMC_A7: length 70.3
  Top Layer w0.3: U7.53 89.62,41.75 v1(88.23,43.14) ; U6.42 43.2,73.56 45.17,71.59 v1(47.84,71.59)
  Bottom Layer w0.3: v1(47.84,71.59) 49.49,71.59 49.94,71.14 49.94,62.87 54.9,57.91 56.53,57.91 64.35,50.09 64.35,48.48 64.86,47.97 65.75,47.97 67.49,49.71 80,49.71 86.57,43.14 v1(88.23,43.14)
FSMC_A8: length 80.7
  Top Layer w0.3: v1(91.15,69.56) 73.11,69.56 61.94,80.73 58.13,80.73 55.2,77.81 U6.27 ; v1(96.86,43.78) 96.23,43.14 93.95,43.14 93.06,42.25 U7.54
  Bottom Layer w0.3: v1(91.15,69.56) 92.16,69.56 98.71,63.01 98.71,45.63 v1(96.86,43.78)
FSMC_A9: length 77.6
  Top Layer w0.3: U6.26 56,77.72 58.25,79.97 61.81,79.97 73.24,68.54 v1(91.28,68.54) ; U7.55 92.92,42.75 93.95,43.78 v1(95.34,43.78)
  Bottom Layer w0.3: v1(95.34,43.78) 96,43.78 98.26,46.03 98.26,62.57 92.29,68.54 v1(91.28,68.54)
FSMC_A10: length 74.1
  Top Layer w0.3: U7.56 92.78,43.25 93.94,44.41 v1(94.58,44.41) ; v1(91.4,67.65) 73.11,67.65 61.56,79.21 58.51,79.21 56.8,77.5 U6.25
  Bottom Layer w0.3: v1(91.4,67.65) 91.91,67.65 97.7,61.87 97.7,46.39 95.72,44.41 v1(94.58,44.41)
FSMC_A11: length 70.5
  Top Layer w0.3: U6.24 57.6,77.16 59.02,78.58 61.18,78.58 72.99,66.76 91.28,66.76 v1(91.4,66.64) ; U7.57 92.26,43.75 v1(92.93,44.41)
  Bottom Layer w0.3: v1(91.4,66.64) 97.24,60.8 97.24,46.95 95.34,45.05 93.56,45.05 v1(92.93,44.41)
FSMC_A12: length 33.5
  Top Layer w0.3: U7.87 81.95,58.94 80.35,60.54 v1(79.72,60.54) ; U6.22 58.4,62.94 59.02,62.32 v1(59.91,62.32)
  Bottom Layer w0.3: v1(79.72,60.54) 78.19,60.54 76.7,59.05 65.59,59.05 62.32,62.32 v1(59.91,62.32)
FSMC_A13: length 33.3
  Top Layer w0.3: v1(79.72,59.65) 80.1,59.65 81.45,58.3 U7.88 ; U6.21 57.6,62.59 58.76,61.43 v1(59.91,61.43)
  Bottom Layer w0.3: v1(79.72,59.65) 78.45,59.65 77.39,58.6 64.9,58.6 62.07,61.43 v1(59.91,61.43)
FSMC_A14: length 33.2
  Top Layer w0.3: v1(59.65,60.54) 59.53,60.67 58.51,60.67 56.8,62.38 U6.20 ; U7.89 80.95,57.91 79.97,58.89 v1(79.72,58.89)
  Bottom Layer w0.3: v1(59.65,60.54) 62.32,60.54 64.73,58.13 78.19,58.13 78.96,58.89 v1(79.72,58.89)
FSMC_A15: length 33
  Top Layer w0.3: U7.90 80.45,57.27 v1(79.72,58) ; U6.19 56,62.29 58.38,59.91 v1(60.41,59.91)
  Bottom Layer w0.3: v1(60.41,59.91) 61.94,59.91 64.41,57.44 79.15,57.44 v1(79.72,58)
FSMC_A16: length 42.8
  Top Layer w0.3: U7.80 85.45,56.49 86.7,57.75 v1(86.7,61.3) ; U6.18 55.2,62.96 v1(55.33,62.83)
  Bottom Layer w0.3: v1(86.7,61.3) 84.29,63.72 56.22,63.72 v1(55.33,62.83)
FSMC_A17: length 45
  Top Layer w0.3: U7.81 84.95,56.76 85.94,57.75 85.94,61.81 83,64.75 74.11,64.75 60.79,78.07 59.4,78.07 58.4,77.07 U6.23
FSMC_A18: length 46.3
  Top Layer w0.3: U6.28 54.4,74.43 54.95,73.88 63.97,73.88 73.55,64.3 82.69,64.3 85.43,61.56 85.43,58 84.45,57.02 U7.82
FSMC_D0: length 105
  Top Layer w0.3: U7.85 82.95,59.22 78.58,63.59 61.56,63.59 53.94,71.21 49.34,71.21 46.4,68.27 U6.7 46.4,63.38 46.82,62.95 v1(48.09,62.95)
  Bottom Layer w0.3: v1(48.09,62.95) 48.09,64.1 44.92,67.27 44.92,69.81 42.28,72.45 15.29,72.45 CN3.18
FSMC_D1: length 142
  Top Layer w0.3: U6.8 47.2,67.41 ; 47.2,67.41 47.21,67.41 47.21,68.29 49.67,70.76 53.75,70.76 61.37,63.14 78.4,63.14 82.45,59.08 U7.86 ; 47.2,67.41 v1(47.21,67.4) ; v1(37.17,78.45) 37.3,78.58 37.3,88.48 33.11,92.67 15.36,92.67 14.69,93.34 v1(14.69,93.94)
  Bottom Layer w0.3: CN3.17 2.5,67.66 2.5,86.32 5.42,89.24 9.23,89.24 13.93,93.94 v1(14.69,93.94) ; v1(37.17,78.45) 37.17,74.26 37.99,73.44 42.82,73.44 45.82,70.43 45.82,68.78 v1(47.21,67.4)
FSMC_D2: length 84
  Top Layer w0.3: U6.9 48,66.48 v1(47.97,66.51) 47.97,67.14 49.11,68.29 v1(53.94,68.29) ; U7.114 67.89,48.75 v1(65.11,51.52)
  Bottom Layer w0.3: v1(65.11,51.52) 64.1,52.54 63.18,52.54 56.91,58.82 55.28,58.82 53.68,60.41 53.68,68.03 v1(53.94,68.29) ; CN3.16 8.16,67.47 13.68,72.99 42.51,72.99 45.37,70.12 45.37,68.34 47.21,66.51 v1(47.97,66.51)
FSMC_D3: length 121.3
  Top Layer w0.3: v1(48.86,67.02) 48.8,66.96 U6.10 ; v1(62.45,50.38) 62.7,50.64 65.24,50.64 67.62,48.25 U7.115 ; v1(37.94,79.46) 37.94,88.61 33.24,93.31 v1(15.96,93.31)
  Bottom Layer w0.3: CN3.15 3.01,69.69 3.01,86.07 5.68,88.73 9.49,88.73 14.06,93.31 v1(15.96,93.31) ; v1(37.94,79.46) 37.94,77.31 39.84,75.4 42.25,75.4 46.82,70.83 46.82,69.56 47.59,68.8 48.35,68.8 48.86,68.29 v1(48.86,67.02) 48.86,62.68 54.55,56.98 56.18,56.98 62.45,50.72 v1(62.45,50.38)
FSMC_D4: length 108.9
  Top Layer w0.3: v1(86.07,44.54) 86.36,44.25 U7.58 ; v1(51.02,66.89) 51.2,66.71 U6.13 51.2,62.14 53.43,59.91 v1(55.97,59.91)
  Bottom Layer w0.3: CN3.14 18.75,80.99 37.68,80.99 41.11,77.56 45.94,77.56 51.02,72.48 v1(51.02,66.89) ; v1(86.07,44.54) 85.81,44.54 80.19,50.17 69.65,50.17 66.26,53.56 63.45,53.56 57.1,59.91 v1(55.97,59.91)
FSMC_D5: length 141
  Top Layer w0.3: v1(23.46,81.75) 23.46,89.75 22.31,90.89 3.39,90.89 0.98,88.48 0.98,74.26 CN3.13 ; v1(55.21,60.67) 53.56,60.67 52,62.22 U6.14 52.03,64.38 52.03,66.26 51.78,66.51 v1(51.78,67.4) ; v1(86.07,45.43) 86.75,44.75 U7.59
  Bottom Layer w0.3: v1(51.78,67.4) 51.78,72.48 46.06,78.19 41.36,78.19 37.94,81.62 23.58,81.62 v1(23.46,81.75) ; v1(86.07,45.43) 85.81,45.43 80.62,50.62 70.08,50.62 66.64,54.06 63.58,54.06 57.1,60.54 55.33,60.54 v1(55.21,60.67)
FSMC_D6: length 108.6
  Top Layer w0.3: v1(55.97,61.3) 53.68,61.3 52.8,62.19 U6.15 52.79,64.35 v1(52.79,66.38) ; v1(86.07,46.32) 87.13,45.25 U7.60
  Bottom Layer w0.3: CN3.12 17.61,82.39 38.19,82.39 41.87,78.7 46.44,78.7 52.41,72.73 52.41,66.76 v1(52.79,66.38) ; v1(55.97,61.3) 56.98,61.3 63.71,54.57 67.02,54.57 70.52,51.07 81.31,51.07 v1(86.07,46.32)
FSMC_D7: length 136.4
  Top Layer w0.3: v1(22.31,83.27) 22.95,83.91 22.95,89.37 21.93,90.39 3.64,90.39 1.49,88.23 1.49,76.29 CN3.11 ; v1(55.08,61.94) 53.81,61.94 53.6,62.15 U6.16 53.6,66.85 v1(53.05,67.4) ; U7.63 87.16,46.75 v1(86.07,47.84)
  Bottom Layer w0.3: v1(86.07,47.84) 82.38,51.52 70.96,51.52 67.4,55.08 63.84,55.08 56.99,61.94 v1(55.08,61.94) ; v1(53.05,67.4) 53.05,73.24 46.95,79.34 42.51,79.34 38.57,83.27 v1(22.31,83.27)
FSMC_D8: length 143.2
  Top Layer w0.3: v1(96.48,47.84) 95.89,47.25 U7.64 ; v1(9.87,76.16) 8.8,75.09 CN3.10 ; v1(88.48,70.32) 73.24,70.32 62.19,81.37 56.6,81.37 56.22,81 v1(56.22,79.97) 53.6,77.35 U6.29
  Bottom Layer w0.3: v1(9.87,76.16) 9.49,76.54 9.49,86.07 13.93,90.51 42.38,90.51 43.98,88.92 43.98,86 44.54,85.43 52.03,85.43 56.22,81.24 v1(56.22,79.97) ; v1(88.48,70.32) 88.48,68.43 96.74,60.17 96.74,48.09 v1(96.48,47.84)
FSMC_D9: length 150.3
  Top Layer w0.3: v1(95.97,48.6) 95.12,47.75 U7.65 ; v1(13.93,89.37) 13.42,89.88 3.9,89.88 1.99,87.97 1.99,78.33 CN3.9 ; U6.30 52.8,77.44 v1(55.46,80.1) 55.46,81.11 56.35,82 62.57,82 73.5,71.08 v1(87.72,71.08)
  Bottom Layer w0.3: v1(13.93,89.37) 14.44,89.88 42.25,89.88 43.52,88.61 43.52,85.69 44.28,84.92 51.65,84.92 55.46,81.11 v1(55.46,80.1) ; v1(87.72,71.08) 87.72,68.55 96.1,60.17 96.1,48.73 v1(95.97,48.6)
FSMC_D10: length 132.9
  Top Layer w0.3: U6.31 52,77.53 54.57,80.1 v1(54.57,80.35) 54.57,80.87 56.34,82.64 62.83,82.64 73.62,71.84 v1(87.08,71.84) ; v1(10.76,78.83) 9.56,77.63 CN3.8 ; v1(95.47,49.24) 94.48,48.25 U7.66
  Bottom Layer w0.3: v1(54.57,80.35) 54.57,81.24 51.4,84.42 43.01,84.42 40.22,87.21 13.3,87.21 10.25,84.16 10.25,79.34 v1(10.76,78.83) ; v1(95.47,49.24) 95.47,60.17 87.08,68.55 v1(87.08,71.84)
FSMC_D11: length 142.1
  Top Layer w0.3: v1(94.58,49.49) 94.58,49.36 93.96,48.75 U7.67 ; v1(14.06,86.58) 13.55,86.58 10.76,89.37 4.15,89.37 2.63,87.85 2.63,80.23 CN3.7 ; U6.32 51.2,77.87 v1(53.81,80.48) 53.81,80.86 56.35,83.4 62.83,83.4 73.62,72.61 v1(86.32,72.61)
  Bottom Layer w0.3: v1(14.06,86.58) 39.97,86.58 42.63,83.91 51.26,83.91 53.81,81.36 v1(53.81,80.48) ; v1(86.32,72.61) 86.32,68.67 94.58,60.41 v1(94.58,49.49)
FSMC_D12: length 120.5
  Top Layer w0.3: v1(68.67,67.53) 68.67,68.03 63.34,73.37 49.81,73.37 48.8,74.38 U6.35 48.8,83.08 v1(48.73,83.15) ; U7.68 93.06,49.25 v1(93.81,50) ; v1(11.65,81.11) 10.7,80.17 CN3.6
  Bottom Layer w0.3: v1(11.65,81.11) 10.76,82 10.76,83.53 13.2,85.97 39.56,85.97 42.38,83.15 v1(48.73,83.15) ; v1(68.67,67.53) 86.45,67.53 93.81,60.16 v1(93.81,50)
FSMC_D13: length 120.8
  Top Layer w0.3: v1(68.92,66.26) 62.32,72.86 49.52,72.86 48,74.38 U6.36 48,81.84 v1(47.84,82) ; CN3.5 3.14,82.26 3.14,87.47 4.41,88.73 10.38,88.73 13.81,85.31 v1(14.06,85.31) ; v1(89.12,62.95) 89.12,57.75 86.96,55.59 86.96,53.31 U7.77
  Bottom Layer w0.3: v1(89.12,62.95) 89.12,63.84 86.7,66.26 v1(68.92,66.26) ; v1(14.06,85.31) 14.19,85.18 39.33,85.18 42.51,82 v1(47.84,82)
FSMC_D14: length 104.7
  Top Layer w0.3: v1(68.92,65.24) 61.81,72.35 49.23,72.35 47.2,74.38 U6.37 47.2,80.87 v1(46.95,81.11) ; v1(11.65,82.64) 11.58,82.71 CN3.4 ; v1(88.23,62.95) 88.23,57.62 86.45,55.84 86.45,53.3
  Bottom Layer w0.3: v1(46.95,81.11) 42.38,81.11 38.82,84.67 13.68,84.67 v1(11.65,82.64) ; v1(88.23,62.95) 88.23,63.33 86.32,65.24 v1(68.92,65.24)
FSMC_D15: length 113.6
  Top Layer w0.3: v1(46.44,80.1) 46.4,80.06 U6.38 46.4,74.43 49.11,71.72 61.43,71.72 v1(68.8,64.35) ; v1(87.34,62.95) 87.34,57.62 85.94,56.22 85.94,53.31 U7.79 ; v1(14.06,84.04) 9.87,88.23 4.66,88.23 3.77,87.34 3.77,83.53 4.59,82.71 CN3.3
  Bottom Layer w0.3: v1(14.06,84.04) 38.7,84.04 42.63,80.1 v1(46.44,80.1) ; v1(87.34,62.95) 85.94,64.35 v1(68.8,64.35)
FSMC_NBL0: length 69.2
  Top Layer w0.3: U7.141 62.84,35.25 v1(61.68,36.41) ; v1(40.09,57.37) 39.71,57.75 39.71,76.51 41.02,77.81 44.72,77.81 45.6,76.93 U6.39
  Bottom Layer w0.3: v1(40.09,57.37) 40.09,54.95 45.79,49.25 51.61,49.25 62.06,38.8 62.06,36.79 v1(61.68,36.41)
FSMC_NBL1: length 68.8
  Top Layer w0.3: v1(40.35,58.25) 40.22,58.38 40.22,76.16 41.36,77.31 44.16,77.31 44.8,76.66 U6.40 ; U7.142 62.2,34.75 v1(61.3,35.65)
  Bottom Layer w0.3: v1(61.3,35.65) 61.81,35.65 62.57,36.41 62.57,38.93 51.8,49.71 45.98,49.71 41.11,54.58 41.11,57.49 v1(40.35,58.25)
FSMC_NE3: length 47.1
  Top Layer w0.3: v1(46.19,59.27) 46.19,58.76 45.6,58.17 ; U7.125 72.21,43.25 v1(72.73,43.78) ; 45.6,58.17 R10.1 ; 45.6,58.17 U6.6
  Bottom Layer w0.3: v1(46.19,59.27) 46.19,54.19 47.43,52.95 53.04,52.95 61.69,44.29 72.22,44.29 v1(72.73,43.78)
FSMC_NE4: length 71.4
  Top Layer w0.3: U7.127 65.75,42.25 65.24,42.76 64.35,42.76 64.1,42.51 61.3,42.51 59.27,40.47 v1(59.27,40.09)
  Bottom Layer w0.3: CN3.22 7.83,59.91 12.66,59.91 16.73,55.84 37.43,55.84 44.92,48.35 51.02,48.35 v1(59.27,40.09)
FSMC_NOE: length 135.6
  Top Layer w0.3: U7.118 67.98,46.75 65.11,49.62 v1(65.11,49.75) ; v1(38.95,78.45) 38.95,90 34.25,94.7 v1(15.96,94.7) ; U6.41 44,74.29 45.94,72.35 v1(47.46,72.35)
  Bottom Layer w0.3: CN3.19 1.99,65.63 1.99,86.96 5.04,90 9.11,90 13.81,94.7 v1(15.96,94.7) ; v1(65.11,49.75) 65.11,49.97 56.72,58.37 55.09,58.37 50.4,63.06 50.4,71.57 49.62,72.35 v1(47.46,72.35) 47.46,75.15 45.68,76.92 40.47,76.92 v1(38.95,78.45)
FSMC_NWE: length 94.2
  Top Layer w0.3: v1(38.57,74.26) v1(36.28,74.26) ; v1(47.97,68.16) 49.37,69.56 53.94,69.56 54.7,68.8 54.7,67.4 54.4,67.1 U6.17 54.4,62.87 v1(54.44,62.83) ; U7.119 67.72,46.25 65.24,48.73 v1(65.11,48.73) ; v1(13.68,74.26) 10,70.57 10,63.59 8.8,62.39 CN3.20
  Bottom Layer w0.3: v1(13.68,74.26) v1(36.28,74.26) ; v1(65.11,48.73) 67.02,50.64 67.02,51.91 65.88,53.05 63.32,53.05 57.09,59.27 55.59,59.27 54.44,60.41 v1(54.44,62.83) ; v1(47.97,68.16) 47.21,68.16 46.28,69.09 46.28,70.62 42.64,74.26 v1(38.57,74.26)
GC_CE: length 35.3
  Top Layer w0.3: 84.5,77 84.5,75.32 85.56,74.26 92.16,74.26 95.85,70.57 95.85,62.95 88.45,55.55 U7.74
GC_RST: length 54.3
  Top Layer w0.3: 74.5,77 74.5,81.87 76.03,83.4 84.54,83.4 97.24,70.7 97.24,63.46 88.95,55.17 U7.73
KEY_ON: length 70.5
  Top Layer w0.3: v1(64.1,35.9) 64.25,35.75 U7.140 ; R3.1 26.25,67.77 27.39,68.92 33.24,68.92 39.21,62.95 39.21,52.92 v1(39.46,52.67)
  Top Layer w0.5: R3.1 25.75,67.72 Q2.3
  Bottom Layer w0.3: v1(64.1,35.9) 63.84,35.9 62.46,34.52 60.4,34.52 58.51,36.41 58.51,40.19 50.99,47.71 44.41,47.71 v1(39.46,52.67)
L_IN: length 119.5
  Top Layer w0.3: U7.133 73.07,39.25 73.5,38.82 73.5,35.64 v1(75.15,34) ; CN2.3 67.36,9.36 73.24,9.36 v1(76.67,12.79)
  CPU2 w0.3: CN1.3 60.03,95.97 60.03,94.07 71.41,82.69 71.41,54.51 80.5,45.42 80.5,45.16 80.61,45.05 80.61,40.73 79.08,39.2 77.69,39.2 75.15,36.67 v1(75.15,34)
  Bottom Layer w0.3: v1(76.67,12.79) 76.67,13.55 78.66,15.54 78.66,30.49 v1(75.15,34)
L_RCK: length 121.4
  Top Layer w0.3: U7.134 72.55,38.75 72.99,38.32 72.99,34.89 v1(74.38,33.49) ; v1(75.4,12.92) 72.3,9.81 65.31,9.81 CN2.2
  CPU2 w0.3: CN1.2 57.5,94.44 70.96,80.99 70.96,54.32 80.04,45.23 80.04,40.92 78.96,39.84 77.56,39.84 74.38,36.66 v1(74.38,33.49)
  Bottom Layer w0.3: v1(74.38,33.49) 78.21,29.67 78.21,15.85 75.4,13.04 v1(75.4,12.92)
L_SCK: length 123.1
  Top Layer w0.3: v1(74.38,13.04) 71.61,10.26 63.26,10.26 CN2.1 ; U7.135 72.04,38.25 72.48,37.81 72.48,34.38 v1(73.24,33.62)
  CPU2 w0.3: v1(73.24,33.62) 73.24,36.16 77.43,40.35 78.83,40.35 79.59,41.11 79.59,44.92 70.45,54.06 70.45,78.83 55,94.28 CN1.1
  Bottom Layer w0.3: v1(74.38,13.04) 77.75,16.41 77.75,29.1 v1(73.24,33.62)
LCD_BL: length 84.7
  Top Layer w0.3: v1(21.68,54.95) 21.17,55.46 R20.1 ; U7.76 87.45,55.19 89.75,57.49 v1(89.75,59.14) ; v1(40.86,50.25) 45.43,54.83 58,54.83 v1(61.94,58.76)
  Bottom Layer w0.3: v1(40.86,50.25) 36.16,54.95 v1(21.68,54.95) ; v1(61.94,58.76) 63.72,56.98 87.59,56.98 v1(89.75,59.14)
LED_1: length 48.7
  Top Layer w0.3: U7.19 80.45,34.48 81.5,35.52 81.5,37.44 79.46,39.47 79.46,41.75 v1(78.83,42.38)
  CPU2 w0.3: v1(57.24,66.13) 59.65,66.13 63.34,62.45 63.34,56.1 77.06,42.38 v1(78.83,42.38)
  Bottom Layer w0.3: LED2.2 58,66.89 v1(57.24,66.13)
LED_2: length 46.1
  Top Layer w0.3: v1(78.83,43.27) 79.08,43.27 79.97,42.38 79.97,39.6 81.95,37.62 81.95,35.21 80.95,34.21 U7.20
  CPU2 w0.3: v1(61.18,65.88) 63.84,63.21 63.84,56.23 76.81,43.27 v1(78.83,43.27)
  Bottom Layer w0.3: v1(61.18,65.88) 60.5,66.55 LED3.2
LED_PWR: length 58.8
  Top Layer w0.3: U7.18 79.95,34.62 80.99,35.65 80.99,37.31 78.83,39.46 v1(78.83,41.49)
  CPU2 w0.3: v1(43.14,66.51) 43.14,65.62 53.68,55.08 63.72,55.08 77.31,41.49 v1(78.83,41.49)
  Bottom Layer w0.3: v1(43.14,66.51) 43.78,67.15 LED1.2
MCU_RX1: length 85.3
  Top Layer w0.3: U7.102 74.45,47.65 77.63,44.47 77.63,39.26 79.84,37.05 79.84,36.54 v1(79.72,36.41) ; U15.1 46.19,7.94 46.19,5.68 46.57,5.3 72.46,5.3 76.09,8.92 76.09,11.33 76.74,11.97 79.52,11.97 v1(80.1,11.39)
  Bottom Layer w0.3: v1(79.72,36.41) 79.72,31.59 80.23,31.08 80.23,11.52 v1(80.1,11.39)
MCU_RX2: length 94.2
  Top Layer w0.3: v1(84.42,43.4) 84.42,41.49 86.58,39.33 86.58,36.77 89.6,33.74 90.99,33.74 U7.37 ; U9.11 28.79,79.97 27.9,79.08 27.9,77.05 29.55,75.4 32.62,75.4 36.28,71.73 v1(36.28,70.57)
  Bottom Layer w0.3: v1(36.28,70.57) 36.28,67.02 37.81,65.49 44.54,65.49 63.03,47.01 66.18,47.01 67.99,48.81 79.62,48.81 84.42,44.02 v1(84.42,43.4)
MCU_RX3: length 41.9
  Top Layer w0.3: v1(88.35,50.64) 88.74,50.25 U7.70 ; 82.5,77 82.5,75.54 84.29,73.75 92.03,73.75 95.34,70.44 95.34,64.98 v1(91.66,61.3)
  Bottom Layer w0.3: v1(88.35,50.64) 88.35,51.01 91.66,54.31 v1(91.66,61.3)
MCU_TX1: length 89
  Top Layer w0.3: U15.2 43.75,6.09 45.1,4.73 72.54,4.73 76.54,8.73 76.54,11.14 76.92,11.52 78.7,11.52 79.59,10.63 v1(80.48,10.63) ; U7.101 74.95,47.91 78.19,44.67 78.19,39.46 80.35,37.3 v1(80.35,35.9)
  Bottom Layer w0.3: v1(80.35,35.9) 80.35,31.59 80.73,31.21 80.73,10.88 v1(80.48,10.63)
MCU_TX2: length 96.4
  Top Layer w0.3: v1(83.78,42.63) 83.78,41.49 86.07,39.2 86.07,36.54 88.95,33.66 U7.36 ; U9.12 28.66,81.24 27.39,79.97 27.39,76.8 29.3,74.89 32.48,74.89 35.65,71.73 v1(35.65,71.08)
  Bottom Layer w0.3: v1(35.65,71.08) 35.65,67.02 37.68,64.99 44.28,64.99 62.72,46.56 66.37,46.56 68.17,48.35 79.44,48.35 83.78,44.01 v1(83.78,42.63)
MCU_TX3: length 45.5
  Top Layer w0.3: v1(90.64,61.43) 94.58,65.37 94.58,70.45 91.78,73.24 81.62,73.24 80.5,74.36 80.5,77 ; U7.69 91,49.75 87.85,49.75 87.47,50.13 v1(87.47,50.25)
  Bottom Layer w0.3: v1(87.47,50.25) 87.47,51.27 90.89,54.7 90.89,61.18 v1(90.64,61.43)
NRST: length 152
  Top Layer w0.3: SW2.2 92.73,16.35 ; SW2.2 91.59,21.81 v1(91.4,21.81) ; SW2.2 92.92,22.95 R26.2 ; 92.73,16.35 92.73,15.46 C49.2 ; U7.25 83.45,28.74 83.66,28.54 v1(83.66,28.03) ; CN3.1 5.23,86.13 6.44,87.34 9.11,87.34 13.81,82.64 13.81,78.07 18.89,72.99 18.89,62.7 29.41,52.17 32.46,52.17 38.44,46.19 38.44,36.92 37.3,35.78 v1(37.3,34.76) ; v1(81.75,25.36) v1(76.92,25.36)
  Bottom Layer w0.3: v1(76.92,25.36) 76.91,25.38 76.78,25.38 72.86,29.3 56.86,29.3 54.83,31.33 40.73,31.33 v1(37.3,34.76) ; v1(91.4,21.81) 87.97,21.81 84.42,25.36 ; v1(83.66,28.03) 83.53,27.9 83.53,26.25 84.42,25.36 ; 84.42,25.36 v1(81.75,25.36)
OSC32_IN: length 16.4
  Top Layer w0.3: C5.2 71.99,16.96 Y1.2 75.27,22.42 75.27,28.03 74.95,28.35 U7.8
OSC32_OUT: length 15.5
  Top Layer w0.3: U7.9 75.45,28.61 75.73,28.34 75.73,20.86 74.49,19.63 74.49,16.93 C6.2
OSC_IN: length 17.1
  Top Layer w0.3: C7.1 82.33,14.83 Y2.2 82.45,18.08 U7.23
OSC_OUT: length 18.3
  Top Layer w0.3: U7.24 82.95,21.44 86.43,17.96 86.43,14.87 C22.1
OV_PWDN: length 31.7
  Top Layer w0.3: v1(49.24,39.84) 57.88,39.84 61.05,43.02 63.85,43.02 64.59,43.75 U7.124 ; v1(48.35,36.79) 47.75,36.19 47.75,30.56
  Bottom Layer w0.3: v1(48.35,36.79) 49.24,37.68 v1(49.24,39.84)
OV_RESET: length 31
  Top Layer w0.3: U7.132 65.15,39.75 64.4,39 47.38,39 46.75,38.36 46.75,30.56
OV_SCL: length 42.4
  Top Layer w0.3: v1(48.09,41.11) 48.22,40.98 57.62,40.98 60.67,44.03 63.59,44.03 64.31,44.75 U7.122 ; v1(48.09,39.84) 47.59,39.84 46.25,38.5 46.25,25.93 44.91,24.59 R8.1
  Bottom Layer w0.3: v1(48.09,41.11) v1(48.09,39.84)
OV_SDA: length 44.8
  Top Layer w0.3: U7.123 64.45,44.25 63.72,43.52 60.92,43.52 57.87,40.47 47.33,40.47 45.25,38.39 45.25,27.09 44.16,26 40.47,26 39.71,25.24 R9.1
OV_XCLK: length 64.1
  Top Layer w0.3: v1(49.24,36.67) 49.24,33.12 50.25,32.11 50.25,25.86 47.87,23.48 U2.3 ; U7.100 75.45,54.9 74.76,55.59 74.76,58.25 72.5,60.53 68.91,60.53 58.38,50 58.38,45.3 v1(55.08,42)
  Bottom Layer w0.3: v1(55.08,42) 53.68,43.4 51.27,43.4 50.13,42.25 50.13,37.55 v1(49.24,36.67)
PWR_EN: length 47.1
  Top Layer w0.3: D2.2 38.06,58.85 v1(38.06,56.73) ; U7.139 64.77,36.25 64.48,36.54 v1(63.59,36.54)
  Bottom Layer w0.3: v1(38.06,56.73) 38.06,55.85 45.11,48.8 51.42,48.8 59.91,40.32 59.91,35.65 60.59,34.97 62.27,34.97 63.59,36.29 v1(63.59,36.54)
SW_EN: length 27.1
  Top Layer w0.5: R5.2 19.51,43.27 v2(21.04,43.27) ; v2(21.42,45.68) 21.36,45.62 U4.1 ; D2.1 31.2,57.11 D1.1 29.93,57.05 v2(29.93,53.3)
  Bottom Layer w0.5: v2(29.93,53.3) 29.93,51.14 24.47,45.68 v2(21.42,45.68) 21.42,43.65 v2(21.04,43.27)
SWCLK: length 91.8
  Top Layer w0.3: U7.109 71.1,51.25 72.48,49.87 72.48,45.94 76.67,41.75 76.67,38.32 78.32,36.67 v1(78.32,36.41) ; v1(77.31,10.76) 77.31,8.86 72.73,4.28 39.59,4.28 38.75,5.12 U15.4
  Bottom Layer w0.3: v1(77.31,10.76) 77.31,13.42 79.11,15.23 79.11,30.8 78.32,31.59 v1(78.32,36.41)
SWDIO: length 95.3
  Top Layer w0.3: U15.5 36.25,4.95 37.43,3.77 72.86,3.77 78.32,9.23 v1(78.32,10.76) ; v1(79.08,35.65) 79.08,37.17 77.18,39.07 77.18,41.88 72.95,46.1 U7.105
  Bottom Layer w0.3: v1(79.08,35.65) 79.08,31.59 79.72,30.95 79.72,14.95 78.32,13.55 v1(78.32,10.76)
T_CS: length 90.4
  Top Layer w0.3: U7.7 74.45,29.11 74.4,29.06 ; 74.4,29.06 74.4,29.04 ; 74.4,29.06 v1(74.26,28.92) ; CN3.24 10.49,60.03 20.54,60.03 28.85,51.72 32.02,51.72 37.55,46.19 37.55,39.97 v1(36.66,39.08)
  Bottom Layer w0.3: v1(74.26,28.92) 73.37,29.81 57.24,29.81 55.21,31.84 41.1,31.84 36.66,36.28 v1(36.66,39.08)
T_MISO: length 125.2
  Top Layer w0.3: v1(85.94,41.36) 86.47,41.36 88.58,39.25 U7.48 94.16,39.25 R13.1 ; CN3.26 12.4,59.4 20.28,59.4 28.41,51.27 31.59,51.27 37.05,45.81 37.05,42.51 34.76,40.22 34.76,39.08 35.4,38.44 v1(37.43,38.44)
  Bottom Layer w0.3: 58.01,31.59 57.24,31.59 55.97,32.86 43.01,32.86 v1(37.43,38.44) ; 58.01,31.59 58,31.59 ; 58.01,31.59 65.89,31.59 71.83,37.52 82.66,37.52 84.42,35.76 89.35,35.76 90.19,36.6 90.19,39.4 89.75,39.84 86.19,39.84 85.81,40.22 85.81,41.24 v1(85.94,41.36)
T_MOSI: length 123.8
  Top Layer w0.3: v1(85.31,42) 86.47,42 88.72,39.75 U7.49 ; CN3.25 3.72,54.77 1.87,52.92 1.87,45.94 7.45,40.35 31.46,40.35 v1(32.09,39.71)
  Bottom Layer w0.3: v1(85.31,42) 85.31,40.09 86.01,39.39 89.44,39.39 89.74,39.09 89.74,36.79 89.16,36.21 84.61,36.21 82.85,37.98 71.64,37.98 65.76,32.09 57.62,32.09 56.35,33.36 43.78,33.36 37.43,39.71 v1(32.09,39.71)
